# EAGLE schematic RBCX (EAGLE 9.6.0)

## Sheet 1 of 8: Power
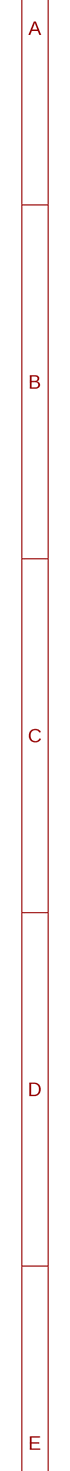
[diagram p0: schematic, sheet 1, part 1 of 2]
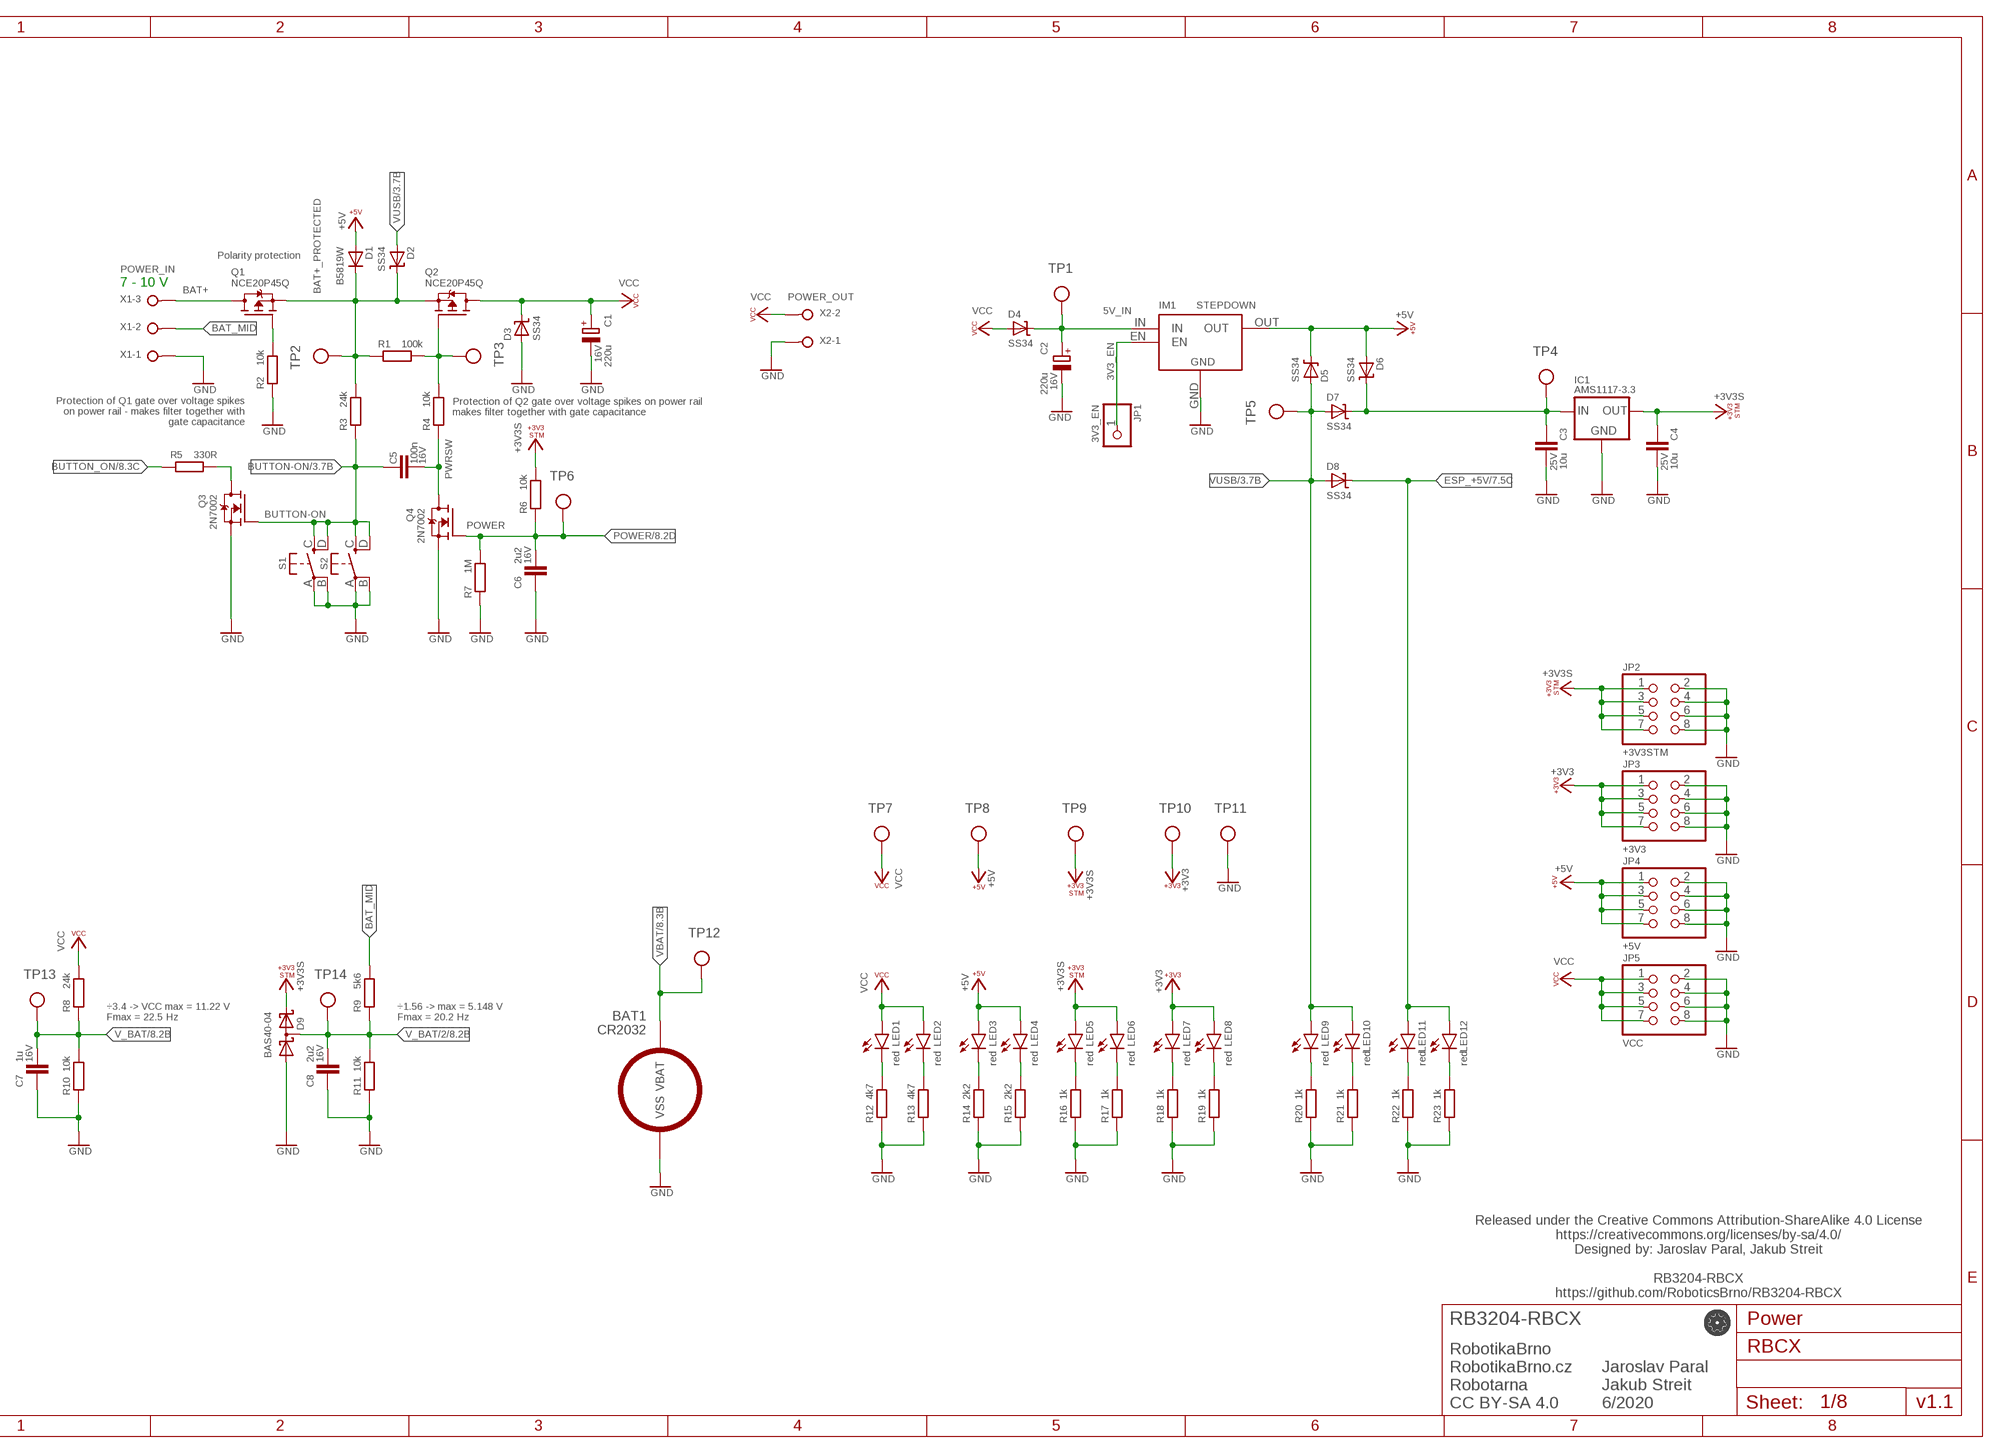
[diagram p1: schematic, sheet 1, part 2 of 2]

### Parts
BAT1  CR2032  CR2032CR2032-BS-6-1  [SMD-BAT-CR2032-BS-6-1]
C1  220u  CPOL-EUE5-10.5  [E5-10,5]
C2  220u  CPOL-EUE5-10.5  [E5-10,5]
C3  10u  C-EUC0805  [C0805]
C4  10u  C-EUC0805  [C0805]
C5  100n  C-EUC0402  [C0402]
C6  2u2  C-EUC0603  [C0603]
C7  1u  C-EUC0402  [C0402]
C8  2u2  C-EUC0603  [C0603]
D1  B5819W  DIODE-SOD123  [SOD123]
D2  SS34  SHOTTKY-SMA  [SMA]
D3  SS34  SHOTTKY-SMA  [SMA]
D4  SS34  SHOTTKY-SMA  [SMA]
D5  SS34  SHOTTKY-SMA  [SMA]
D6  SS34  SHOTTKY-SMA  [SMA]
D7  SS34  SHOTTKY-SMA  [SMA]
D8  SS34  SHOTTKY-SMA  [SMA]
D9  BAS40-04  [SOT23]
IC1  AMS1117-3.3  AMS1117  [SOT223]
IM1  STEPDOWN  [STEPDOWN]
JP1  3V3_EN  PINHD-1X1  [1X01]
JP2  +3V3STM  PINHD-2X4  [2X04]
JP3  +3V3  PINHD-2X4  [2X04]
JP4  +5V  PINHD-2X4  [2X04]
JP5  VCC  PINHD-2X4  [2X04]
LED1  red  LEDCHIPLED_0603  [CHIPLED_0603]
LED2  red  LEDCHIPLED_0603  [CHIPLED_0603]
LED3  red  LEDCHIPLED_0603  [CHIPLED_0603]
LED4  red  LEDCHIPLED_0603  [CHIPLED_0603]
LED5  red  LEDCHIPLED_0603  [CHIPLED_0603]
LED6  red  LEDCHIPLED_0603  [CHIPLED_0603]
LED7  red  LEDCHIPLED_0603  [CHIPLED_0603]
LED8  red  LEDCHIPLED_0603  [CHIPLED_0603]
LED9  red  LEDCHIPLED_0603  [CHIPLED_0603]
LED10  red  LEDCHIPLED_0603  [CHIPLED_0603]
LED11  red  LEDCHIPLED_0603  [CHIPLED_0603]
LED12  red  LEDCHIPLED_0603  [CHIPLED_0603]
Q1  NCE20P45Q  P-MOSFET-MLP_HS  [MLP3.3X3.3_HS]
Q2  NCE20P45Q  P-MOSFET-MLP_HS  [MLP3.3X3.3_HS]
Q3  2N7002  N-MOSFET-SOT23-GSD  [SOT23]
Q4  2N7002  N-MOSFET-SOT23-GSD  [SOT23]
R1  100k  R-EU_R0402  [R0402]
R2  10k  R-EU_R0402  [R0402]
R3  24k  R-EU_R0402  [R0402]
R4  10k  R-EU_R0402  [R0402]
R5  330R  R-EU_R0402  [R0402]
R6  10k  R-EU_R0402  [R0402]
R7  1M  R-EU_R0402  [R0402]
R8  24k  R-EU_R0402  [R0402]
R9  5k6  R-EU_R0402  [R0402]
R10  10k  R-EU_R0402  [R0402]
R11  10k  R-EU_R0402  [R0402]
R12  4k7  R-EU_R0402  [R0402]
R13  4k7  R-EU_R0402  [R0402]
R14  2k2  R-EU_R0402  [R0402]
R15  2k2  R-EU_R0402  [R0402]
R16  1k  R-EU_R0402  [R0402]
R17  1k  R-EU_R0402  [R0402]
R18  1k  R-EU_R0402  [R0402]
R19  1k  R-EU_R0402  [R0402]
R20  1k  R-EU_R0402  [R0402]
R21  1k  R-EU_R0402  [R0402]
R22  1k  R-EU_R0402  [R0402]
R23  1k  R-EU_R0402  [R0402]
S1  CHOOSE_ME  10-XX_SMD  [TS-1187A]
S2  CHOOSE_ME  10-XX_SMD  [TS-1187A]
TP1  TP_06MM  [TP_06]
TP2  TP_06MM  [TP_06]
TP3  TP_06MM  [TP_06]
TP4  TP_06MM  [TP_06]
TP5  TP_06MM  [TP_06]
TP6  TP_06MM  [TP_06]
TP7  TP_06MM  [TP_06]
TP8  TP_06MM  [TP_06]
TP9  TP_06MM  [TP_06]
TP10  TP_06MM  [TP_06]
TP11  TP_08MM  [TP_08]
TP12  TP_06MM  [TP_06]
TP13  TP_06MM  [TP_06]
TP14  TP_06MM  [TP_06]
X1  POWER_IN  W237-03P  [W237-133]
X2  POWER_OUT  W237-02P  [W237-132]

### Nets
3V3_EN: IM1.EN JP1.1 ; also sheet 2
3V3_IN: C3.2 D6.C D7.C IC1.3(IN) TP4.P$1(TP)
5V_IN: C2.+ D4.C IM1.IN TP1.P$1(TP)
+3V3: JP3.1 JP3.3 JP3.5 JP3.7 LED7.A LED8.A TP10.P$1(TP) ; also sheet 2,3,7
+3V3S: C4.2 D9.2(C2) IC1.2(OUT) IC1.4(OUT) JP2.1 JP2.3 JP2.5 JP2.7 LED5.A LED6.A R6.2 TP9.P$1(TP) ; also sheet 2,3,4,5,6,8
+5V: D1.A D5.C D6.A IM1.OUT JP4.1 JP4.3 JP4.5 JP4.7 LED3.A LED4.A TP8.P$1(TP) ; also sheet 2,3,4,5,6,7
BAT+: Q1.5(D) Q1.6(D) Q1.7(D) Q1.8(D) Q1.9(D) X1.3
BAT+_PROTECTED: D1.C D2.C Q1.1(S) Q1.2(S) Q1.3(S) Q2.1(S) Q2.2(S) Q2.3(S) R1.1 R3.2 TP2.P$1(TP)
BAT_MID: R9.2 X1.2
BUTTON-ON: C5.2 Q3.1(G) R3.1 S1.C(S) S1.D(S1) S2.C(S) S2.D(S1) ; also sheet 3,4
BUTTON-ON-LV: Q3.3(D) R5.2
BUTTON_ON: R5.1 ; also sheet 8
ESP_+5V: D8.C LED11.A LED12.A ; also sheet 7
GND: BAT1.VSS C1.- C2.- C3.1 C4.1 C6.2 C7.2 C8.2 D3.A D9.1(A1) IC1.1(GND) IM1.GND JP2.2 JP2.4 JP2.6 JP2.8 JP3.2 JP3.4 JP3.6 JP3.8 JP4.2 JP4.4 JP4.6 JP4.8 JP5.2 JP5.4 JP5.6 JP5.8 Q3.2(S) Q4.2(S) R2.1 R7.1 R10.1 R11.1 R12.1 R13.1 R14.1 R15.1 R16.1 R17.1 R18.1 R19.1 R20.1 R21.1 R22.1 R23.1 S1.A(P) S1.B(P1) S2.A(P) S2.B(P1) TP11.P$1(TP) X1.1 X2.1 ; also sheet 2,3,4,5,6,7,8
POWER: C6.1 Q4.1(G) R6.1 R7.2 TP6.P$1(TP) ; also sheet 8
PROT_GATE: Q1.4(G) R2.2
PWRLED_+3V3: LED7.C R18.2
PWRLED_+3V3B: LED8.C R19.2
PWRLED_+3V3S: LED5.C R16.2
PWRLED_+3V3S_B: LED6.C R17.2
PWRLED_+5V: LED3.C R14.2
PWRLED_+5V_B: LED4.C R15.2
PWRLED_+5VESP: LED11.C R22.2
PWRLED_+5VESP_B: LED12.C R23.2
PWRLED_VCC: LED1.C R12.2
PWRLED_VCC_B: LED2.C R13.2
PWRLED_VUSB: LED9.C R20.2
PWRLED_VUSB_B: LED10.C R21.2
PWRSW: C5.1 Q4.3(D) R4.1
PWRSW_GATE: Q2.4(G) R1.2 R4.2 TP3.P$1(TP)
V_BAT: C7.1 R8.1 R10.2 TP13.P$1(TP) ; also sheet 8
V_BAT/2: C8.1 D9.3(C1A2) R9.1 R11.2 TP14.P$1(TP) ; also sheet 8
VBAT: BAT1.VBAT TP12.P$1(TP) ; also sheet 8
VCC: C1.+ D3.C D4.A JP5.1 JP5.3 JP5.5 JP5.7 LED1.A LED2.A Q2.5(D) Q2.6(D) Q2.7(D) Q2.8(D) Q2.9(D) R8.2 TP7.P$1(TP) X2.2 ; also sheet 2,3,4,5,6
VUSB: D2.A D5.A D7.A D8.A LED9.A LED10.A TP5.P$1(TP) ; also sheet 3

### Notes on the sheet
- Polarity protection
- 7 - 10 V
- Protection of Q2 gate over voltage spikes on power rail
  makes filter together with gate capacitance
- Protection of Q1 gate over voltage spikes
  on power rail - makes filter together with
  gate capacitance
- ÷3.4 -> VCC max = 11.22 V
  Fmax = 22.5 Hz
- ÷1.56 -> max = 5.148 V
  Fmax = 20.2 Hz
- Released under the Creative Commons Attribution-ShareAlike 4.0 License
  https://creativecommons.org/licenses/by-sa/4.0/
  Designed by: Jaroslav Paral, Jakub Streit
  
  RB3204-RBCX
  https://github.com/RoboticsBrno/RB3204-RBCX
- RB3204-RBCX
- RobotikaBrno
  RobotikaBrno.cz
  Robotarna
  CC BY-SA 4.0
- Jaroslav Paral
  Jakub Streit
  6/2020
- v1.1

## Sheet 2 of 8: Connectors
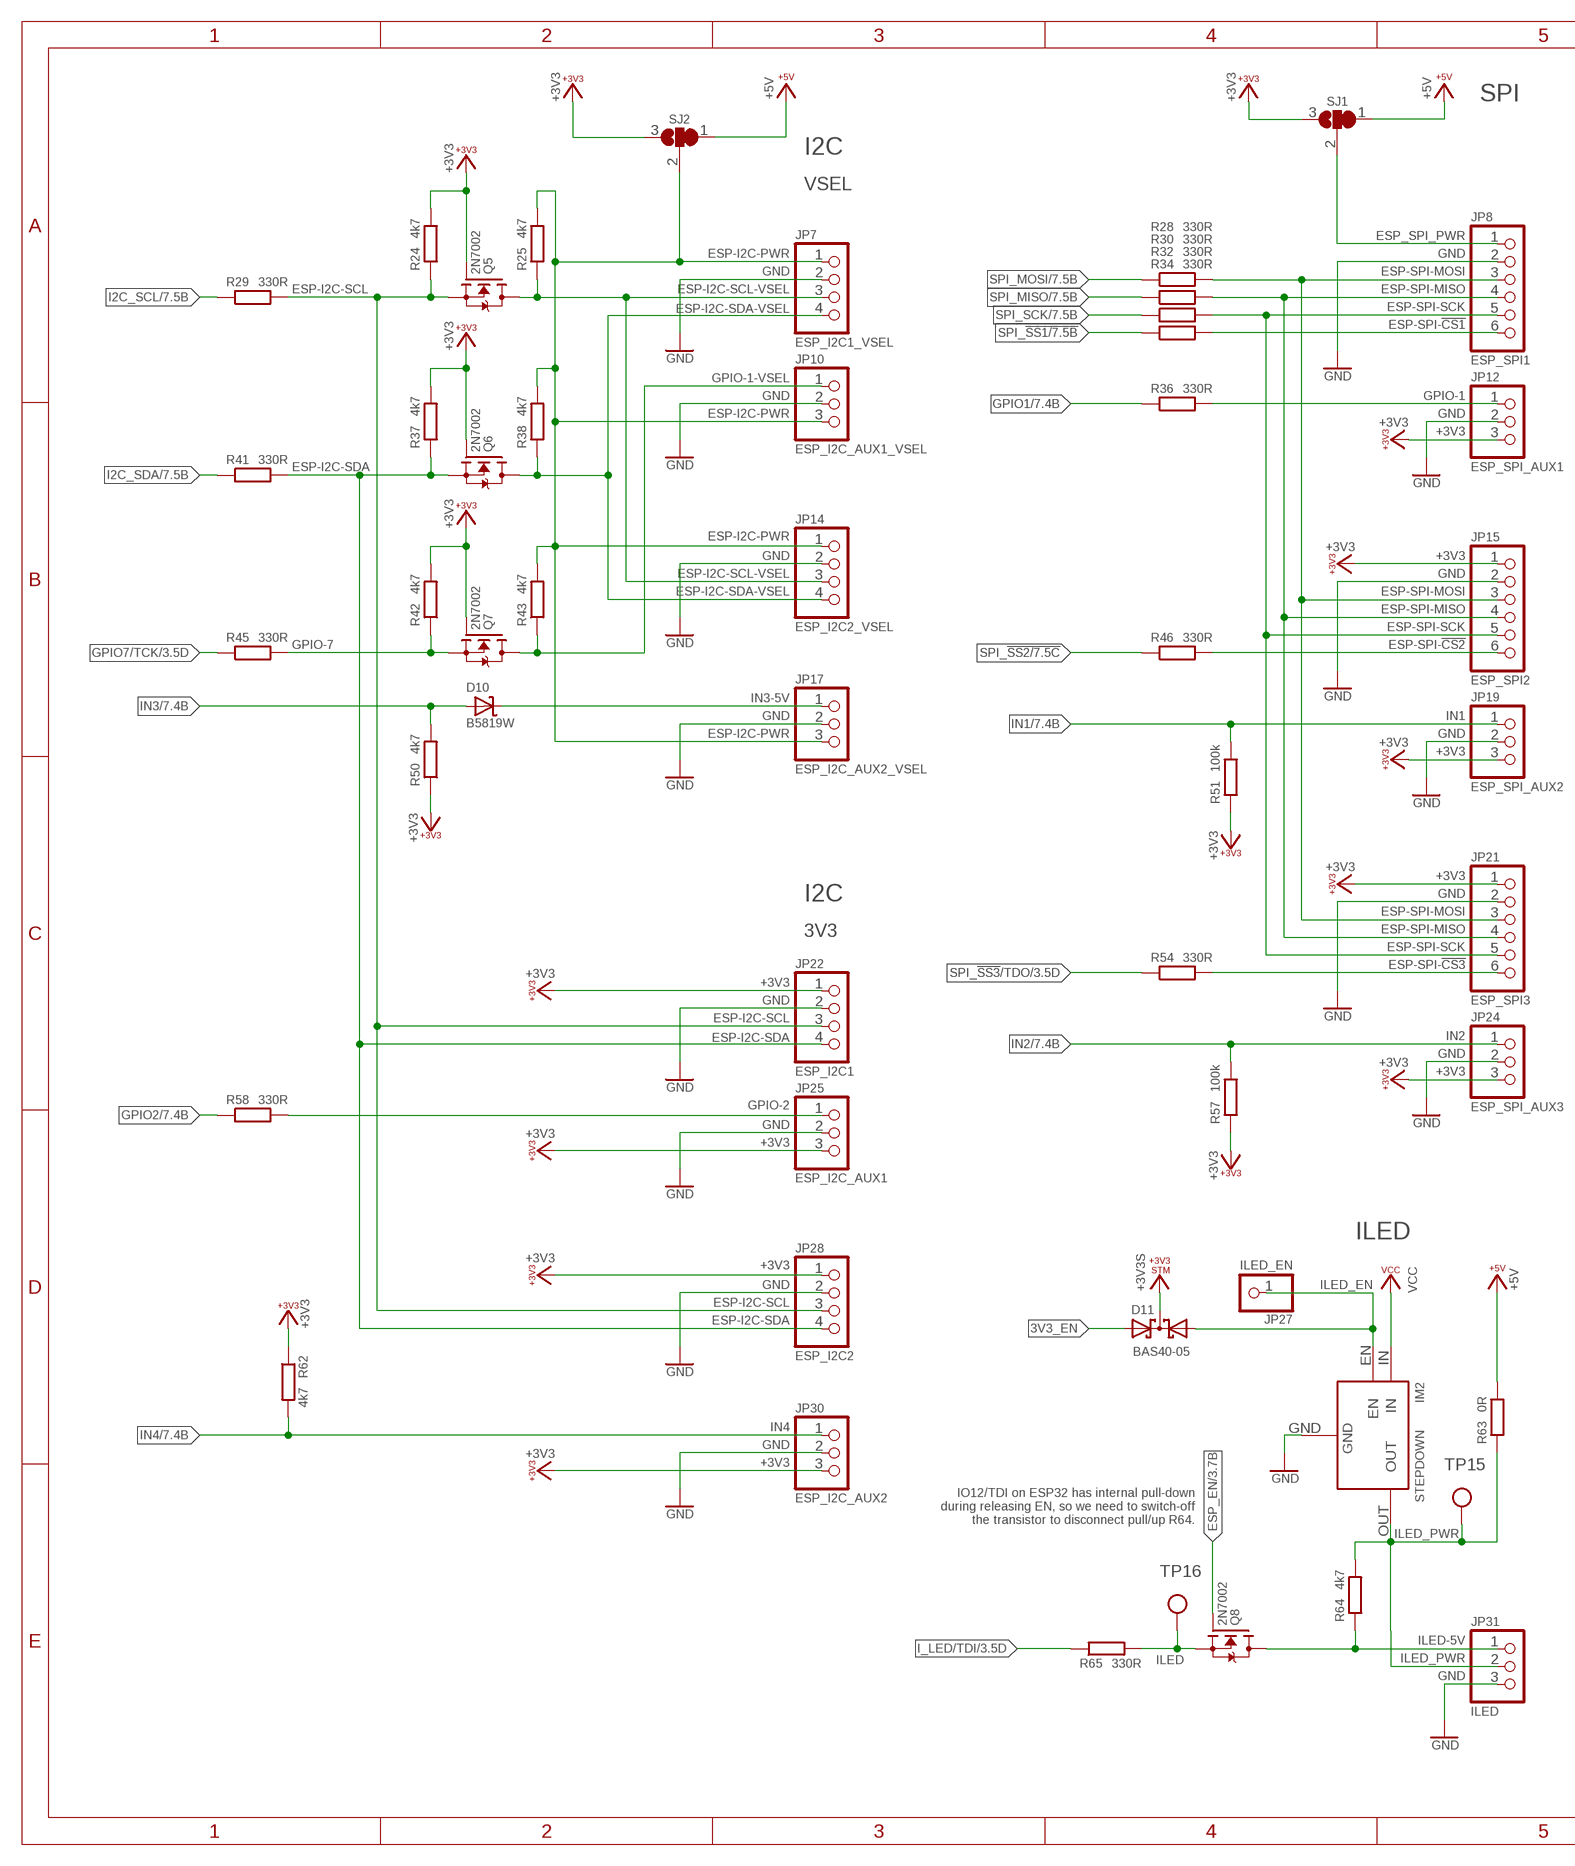
[diagram p2: schematic, sheet 2, part 1 of 2]
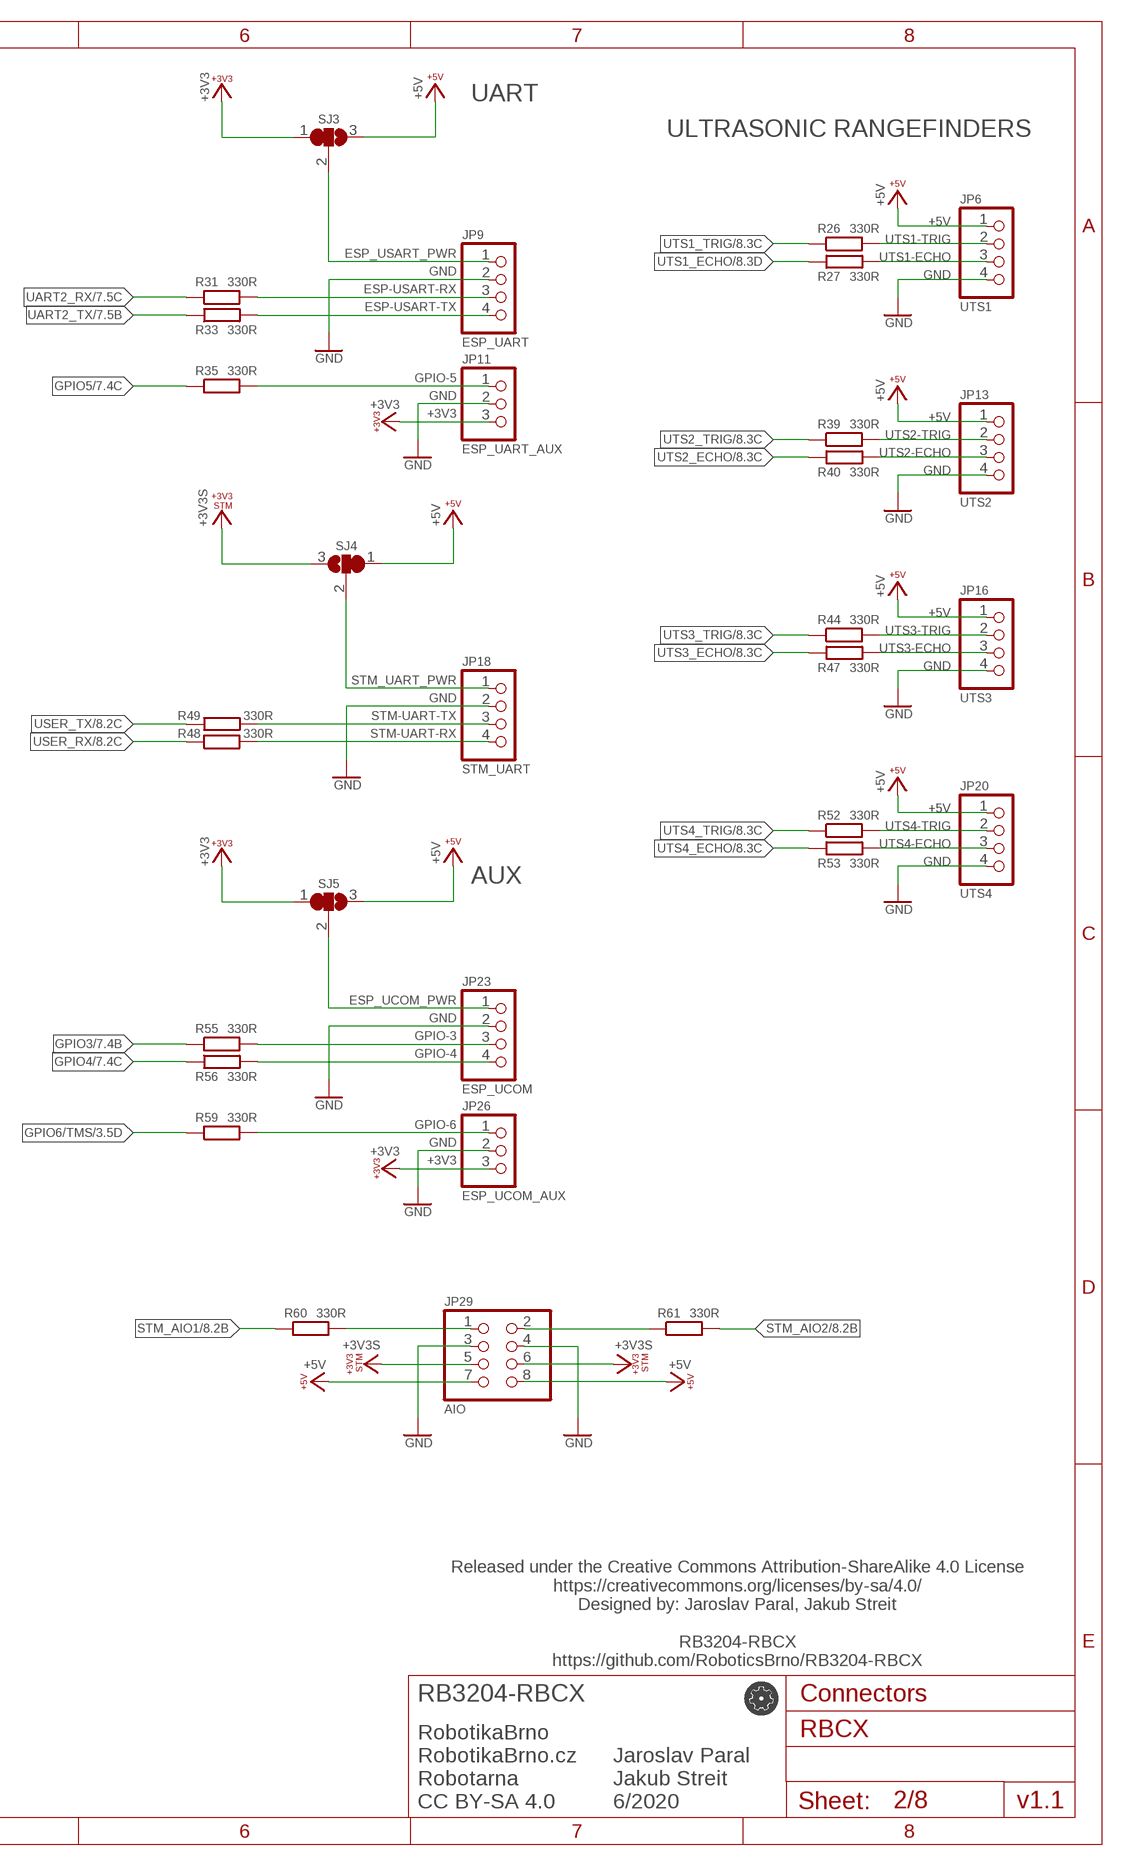
[diagram p3: schematic, sheet 2, part 2 of 2]

### Parts
D10  B5819W  SHOTTKY-SOD123  [SOD123]
D11  BAS40-05  [SOT23]
IM2  STEPDOWN  [STEPDOWN]
JP6  UTS1  PINHD-1X4  [1X04]
JP7  ESP_I2C1_VSEL  PINHD-1X4  [1X04]
JP8  ESP_SPI1  PINHD-1X6  [1X06]
JP9  ESP_UART  PINHD-1X4  [1X04]
JP10  ESP_I2C_AUX1_VSEL  PINHD-1X3  [1X03]
JP11  ESP_UART_AUX  PINHD-1X3  [1X03]
JP12  ESP_SPI_AUX1  PINHD-1X3  [1X03]
JP13  UTS2  PINHD-1X4  [1X04]
JP14  ESP_I2C2_VSEL  PINHD-1X4  [1X04]
JP15  ESP_SPI2  PINHD-1X6  [1X06]
JP16  UTS3  PINHD-1X4  [1X04]
JP17  ESP_I2C_AUX2_VSEL  PINHD-1X3  [1X03]
JP18  STM_UART  PINHD-1X4  [1X04]
JP19  ESP_SPI_AUX2  PINHD-1X3  [1X03]
JP20  UTS4  PINHD-1X4  [1X04]
JP21  ESP_SPI3  PINHD-1X6  [1X06]
JP22  ESP_I2C1  PINHD-1X4  [1X04]
JP23  ESP_UCOM  PINHD-1X4  [1X04]
JP24  ESP_SPI_AUX3  PINHD-1X3  [1X03]
JP25  ESP_I2C_AUX1  PINHD-1X3  [1X03]
JP26  ESP_UCOM_AUX  PINHD-1X3  [1X03]
JP27  ILED_EN  PINHD-1X1  [1X01]
JP28  ESP_I2C2  PINHD-1X4  [1X04]
JP29  AIO  PINHD-2X4  [2X04]
JP30  ESP_I2C_AUX2  PINHD-1X3  [1X03]
JP31  ILED  PINHD-1X3  [1X03]
Q5  2N7002  N-MOSFET-SOT23-GSD  [SOT23]
Q6  2N7002  N-MOSFET-SOT23-GSD  [SOT23]
Q7  2N7002  N-MOSFET-SOT23-GSD  [SOT23]
Q8  2N7002  N-MOSFET-SOT23-GSD  [SOT23]
R24  4k7  R-EU_R0402  [R0402]
R25  4k7  R-EU_R0402  [R0402]
R26  330R  R-EU_R0402  [R0402]
R27  330R  R-EU_R0402  [R0402]
R28  330R  R-EU_R0402  [R0402]
R29  330R  R-EU_R0402  [R0402]
R30  330R  R-EU_R0402  [R0402]
R31  330R  R-EU_R0402  [R0402]
R32  330R  R-EU_R0402  [R0402]
R33  330R  R-EU_R0402  [R0402]
R34  330R  R-EU_R0402  [R0402]
R35  330R  R-EU_R0402  [R0402]
R36  330R  R-EU_R0402  [R0402]
R37  4k7  R-EU_R0402  [R0402]
R38  4k7  R-EU_R0402  [R0402]
R39  330R  R-EU_R0402  [R0402]
R40  330R  R-EU_R0402  [R0402]
R41  330R  R-EU_R0402  [R0402]
R42  4k7  R-EU_R0402  [R0402]
R43  4k7  R-EU_R0402  [R0402]
R44  330R  R-EU_R0402  [R0402]
R45  330R  R-EU_R0402  [R0402]
R46  330R  R-EU_R0402  [R0402]
R47  330R  R-EU_R0402  [R0402]
R48  330R  R-EU_R0402  [R0402]
R49  330R  R-EU_R0402  [R0402]
R50  4k7  R-EU_R0402  [R0402]
R51  100k  R-EU_R0402  [R0402]
R52  330R  R-EU_R0402  [R0402]
R53  330R  R-EU_R0402  [R0402]
R54  330R  R-EU_R0402  [R0402]
R55  330R  R-EU_R0402  [R0402]
R56  330R  R-EU_R0402  [R0402]
R57  100k  R-EU_R0402  [R0402]
R58  330R  R-EU_R0402  [R0402]
R59  330R  R-EU_R0402  [R0402]
R60  330R  R-EU_R0402  [R0402]
R61  330R  R-EU_R0402  [R0402]
R62  4k7  R-EU_R0402  [R0402]
R63  0R  R-EU_R1206  [R1206]
R64  4k7  R-EU_R0402  [R0402]
R65  330R  R-EU_R0402  [R0402]
SJ1  SJ2W_DEFAULT  [SJ_2_DEFAULT]
SJ2  SJ2W_DEFAULT  [SJ_2_DEFAULT]
SJ3  SJ2W_DEFAULT  [SJ_2_DEFAULT]
SJ4  SJ2W_DEFAULT  [SJ_2_DEFAULT]
SJ5  SJ2W_DEFAULT  [SJ_2_DEFAULT]
TP15  TP_06MM  [TP_06]
TP16  TP_06MM  [TP_06]

### Nets
3V3_EN: D11.2(A2) ; also sheet 1
+3V3: JP11.3 JP12.3 JP15.1 JP19.3 JP21.1 JP22.1 JP24.3 JP25.3 JP26.3 JP28.1 JP30.3 Q5.1(G) Q6.1(G) Q7.1(G) R24.2 R37.2 R42.2 R50.1 R51.1 R57.1 R62.1 SJ1.3 SJ2.3 SJ3.1 SJ5.1 ; also sheet 1,3,7
+3V3S: D11.3(C) JP29.5 JP29.6 SJ4.3 ; also sheet 1,3,4,5,6,8
+5V: JP6.1 JP13.1 JP16.1 JP20.1 JP29.7 JP29.8 R63.2 SJ1.1 SJ2.1 SJ3.3 SJ4.1 SJ5.3 ; also sheet 1,3,4,5,6,7
ESP-I2C-PWR: JP7.1 JP10.3 JP14.1 JP17.3 R25.2 R38.2 R43.2 SJ2.2
ESP-I2C-SCL: JP22.3 JP28.3 Q5.2(S) R24.1 R29.2 ; also sheet 8
ESP-I2C-SCL-VSEL: JP7.3 JP14.3 Q5.3(D) R25.1
ESP-I2C-SDA: JP22.4 JP28.4 Q6.2(S) R37.1 R41.2 ; also sheet 8
ESP-I2C-SDA-VSEL: JP7.4 JP14.4 Q6.3(D) R38.1
ESP-SPI-!CS1: JP8.6 R34.2
ESP-SPI-!CS2: JP15.6 R46.2
ESP-SPI-!CS3: JP21.6 R54.2
ESP-SPI-MISO: JP8.4 JP15.4 JP21.4 R30.2
ESP-SPI-MOSI: JP8.3 JP15.3 JP21.3 R28.2
ESP-SPI-SCK: JP8.5 JP15.5 JP21.5 R32.2
ESP-USART-RX: JP9.3 R31.2
ESP-USART-TX: JP9.4 R33.2
ESP_EN: Q8.1(G) ; also sheet 3,4,7,8
ESP_SPI_PWR: JP8.1 SJ1.2
ESP_UCOM_PWR: JP23.1 SJ5.2
ESP_USART_PWR: JP9.1 SJ3.2
GND: IM2.GND JP6.4 JP7.2 JP8.2 JP9.2 JP10.2 JP11.2 JP12.2 JP13.4 JP14.2 JP15.2 JP16.4 JP17.2 JP18.2 JP19.2 JP20.4 JP21.2 JP22.2 JP23.2 JP24.2 JP25.2 JP26.2 JP28.2 JP29.3 JP29.4 JP30.2 JP31.3 ; also sheet 1,3,4,5,6,7,8
GPIO1: R36.1 ; also sheet 7
GPIO2: R58.1 ; also sheet 7
GPIO3: R55.1 ; also sheet 7
GPIO4: R56.1 ; also sheet 7
GPIO5: R35.1 ; also sheet 7
GPIO6/TMS: R59.1 ; also sheet 3,7
GPIO7/TCK: R45.1 ; also sheet 3,7
GPIO-1: JP12.1 R36.2
GPIO-1-VSEL: JP10.1 Q7.3(D) R43.1
GPIO-2: JP25.1 R58.2 ; also sheet 3
GPIO-3: JP23.3 R55.2
GPIO-4: JP23.4 R56.2
GPIO-5: JP11.1 R35.2
GPIO-6: JP26.1 R59.2
GPIO-7: Q7.2(S) R42.1 R45.2
I2C_SCL: R29.1 ; also sheet 7
I2C_SDA: R41.1 ; also sheet 7
I_LED/TDI: R65.1 ; also sheet 3,7
ILED: Q8.2(S) R65.2 TP16.P$1(TP)
ILED-5V: JP31.1 Q8.3(D) R64.1 ; also sheet 3
ILED_EN: D11.1(A1) IM2.EN JP27.1
ILED_PWR: IM2.OUT JP31.2 R63.1 R64.2 TP15.P$1(TP)
IN1: JP19.1 R51.2 ; also sheet 7
IN2: JP24.1 R57.2 ; also sheet 7
IN3: D10.A R50.2 ; also sheet 7
IN3-5V: D10.C JP17.1
IN4: JP30.1 R62.2 ; also sheet 7
SPI_!SS1: R34.1 ; also sheet 7
SPI_!SS2: R46.1 ; also sheet 7
SPI_!SS3!/TDO: R54.1 ; also sheet 3,7
SPI_MISO: R30.1 ; also sheet 7
SPI_MOSI: R28.1 ; also sheet 7
SPI_SCK: R32.1 ; also sheet 7
STM-AIO1: JP29.1 R60.2
STM-AIO2: JP29.2 R61.1
STM-UART-RX: JP18.4 R49.2
STM-UART-TX: JP18.3 R48.2
STM_AIO1: R60.1 ; also sheet 8
STM_AIO2: R61.2 ; also sheet 8
STM_UART_PWR: JP18.1 SJ4.2
UART2_RX: R31.1 ; also sheet 7
UART2_TX: R33.1 ; also sheet 7
USER_RX: R49.1 ; also sheet 8
USER_TX: R48.1 ; also sheet 8
UTS1-ECHO: JP6.3 R27.2
UTS1-TRIG: JP6.2 R26.2
UTS1_ECHO: R27.1 ; also sheet 8
UTS1_TRIG: R26.1 ; also sheet 8
UTS2-ECHO: JP13.3 R40.2
UTS2-TRIG: JP13.2 R39.2
UTS2_ECHO: R40.1 ; also sheet 8
UTS2_TRIG: R39.1 ; also sheet 8
UTS3-ECHO: JP16.3 R47.2
UTS3-TRIG: JP16.2 R44.2
UTS3_ECHO: R47.1 ; also sheet 8
UTS3_TRIG: R44.1 ; also sheet 8
UTS4-ECHO: JP20.3 R53.2
UTS4-TRIG: JP20.2 R52.2
UTS4_ECHO: R53.1 ; also sheet 8
UTS4_TRIG: R52.1 ; also sheet 8
VCC: IM2.IN ; also sheet 1,3,4,5,6

### Notes on the sheet
- SPI | UART
- ULTRASONIC RANGEFINDERS
- I2C
- VSEL
- AUX
- I2C
- 3V3
- ILED
- IO12/TDI on ESP32 has internal pull-down
  during releasing EN, so we need to switch-off
  the transistor to disconnect pull/up R64.
- Released under the Creative Commons Attribution-ShareAlike 4.0 License
  https://creativecommons.org/licenses/by-sa/4.0/
  Designed by: Jaroslav Paral, Jakub Streit
  
  RB3204-RBCX
  https://github.com/RoboticsBrno/RB3204-RBCX
- RB3204-RBCX
- RobotikaBrno
  RobotikaBrno.cz
  Robotarna
  CC BY-SA 4.0
- Jaroslav Paral
  Jakub Streit
  6/2020
- v1.1

## Sheet 3 of 8: Auxiliary connectors
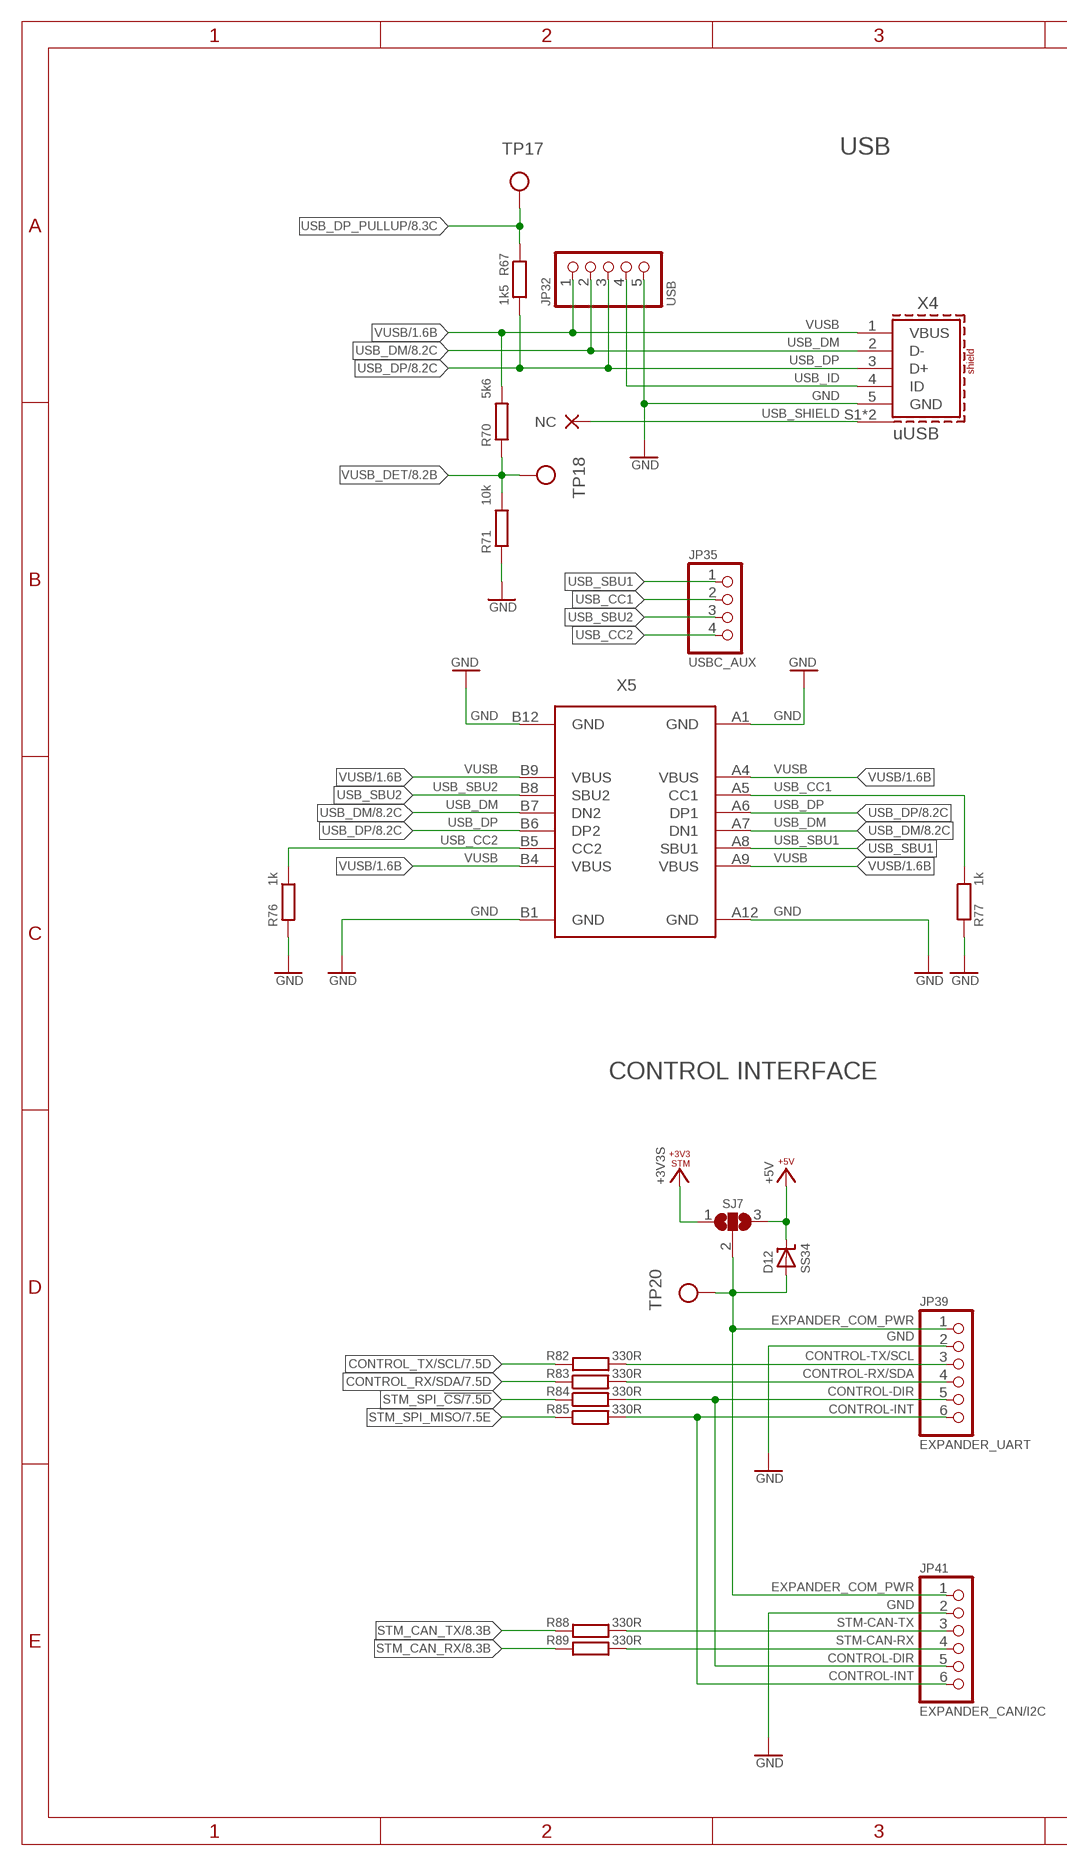
[diagram p4: schematic, sheet 3, part 1 of 2]
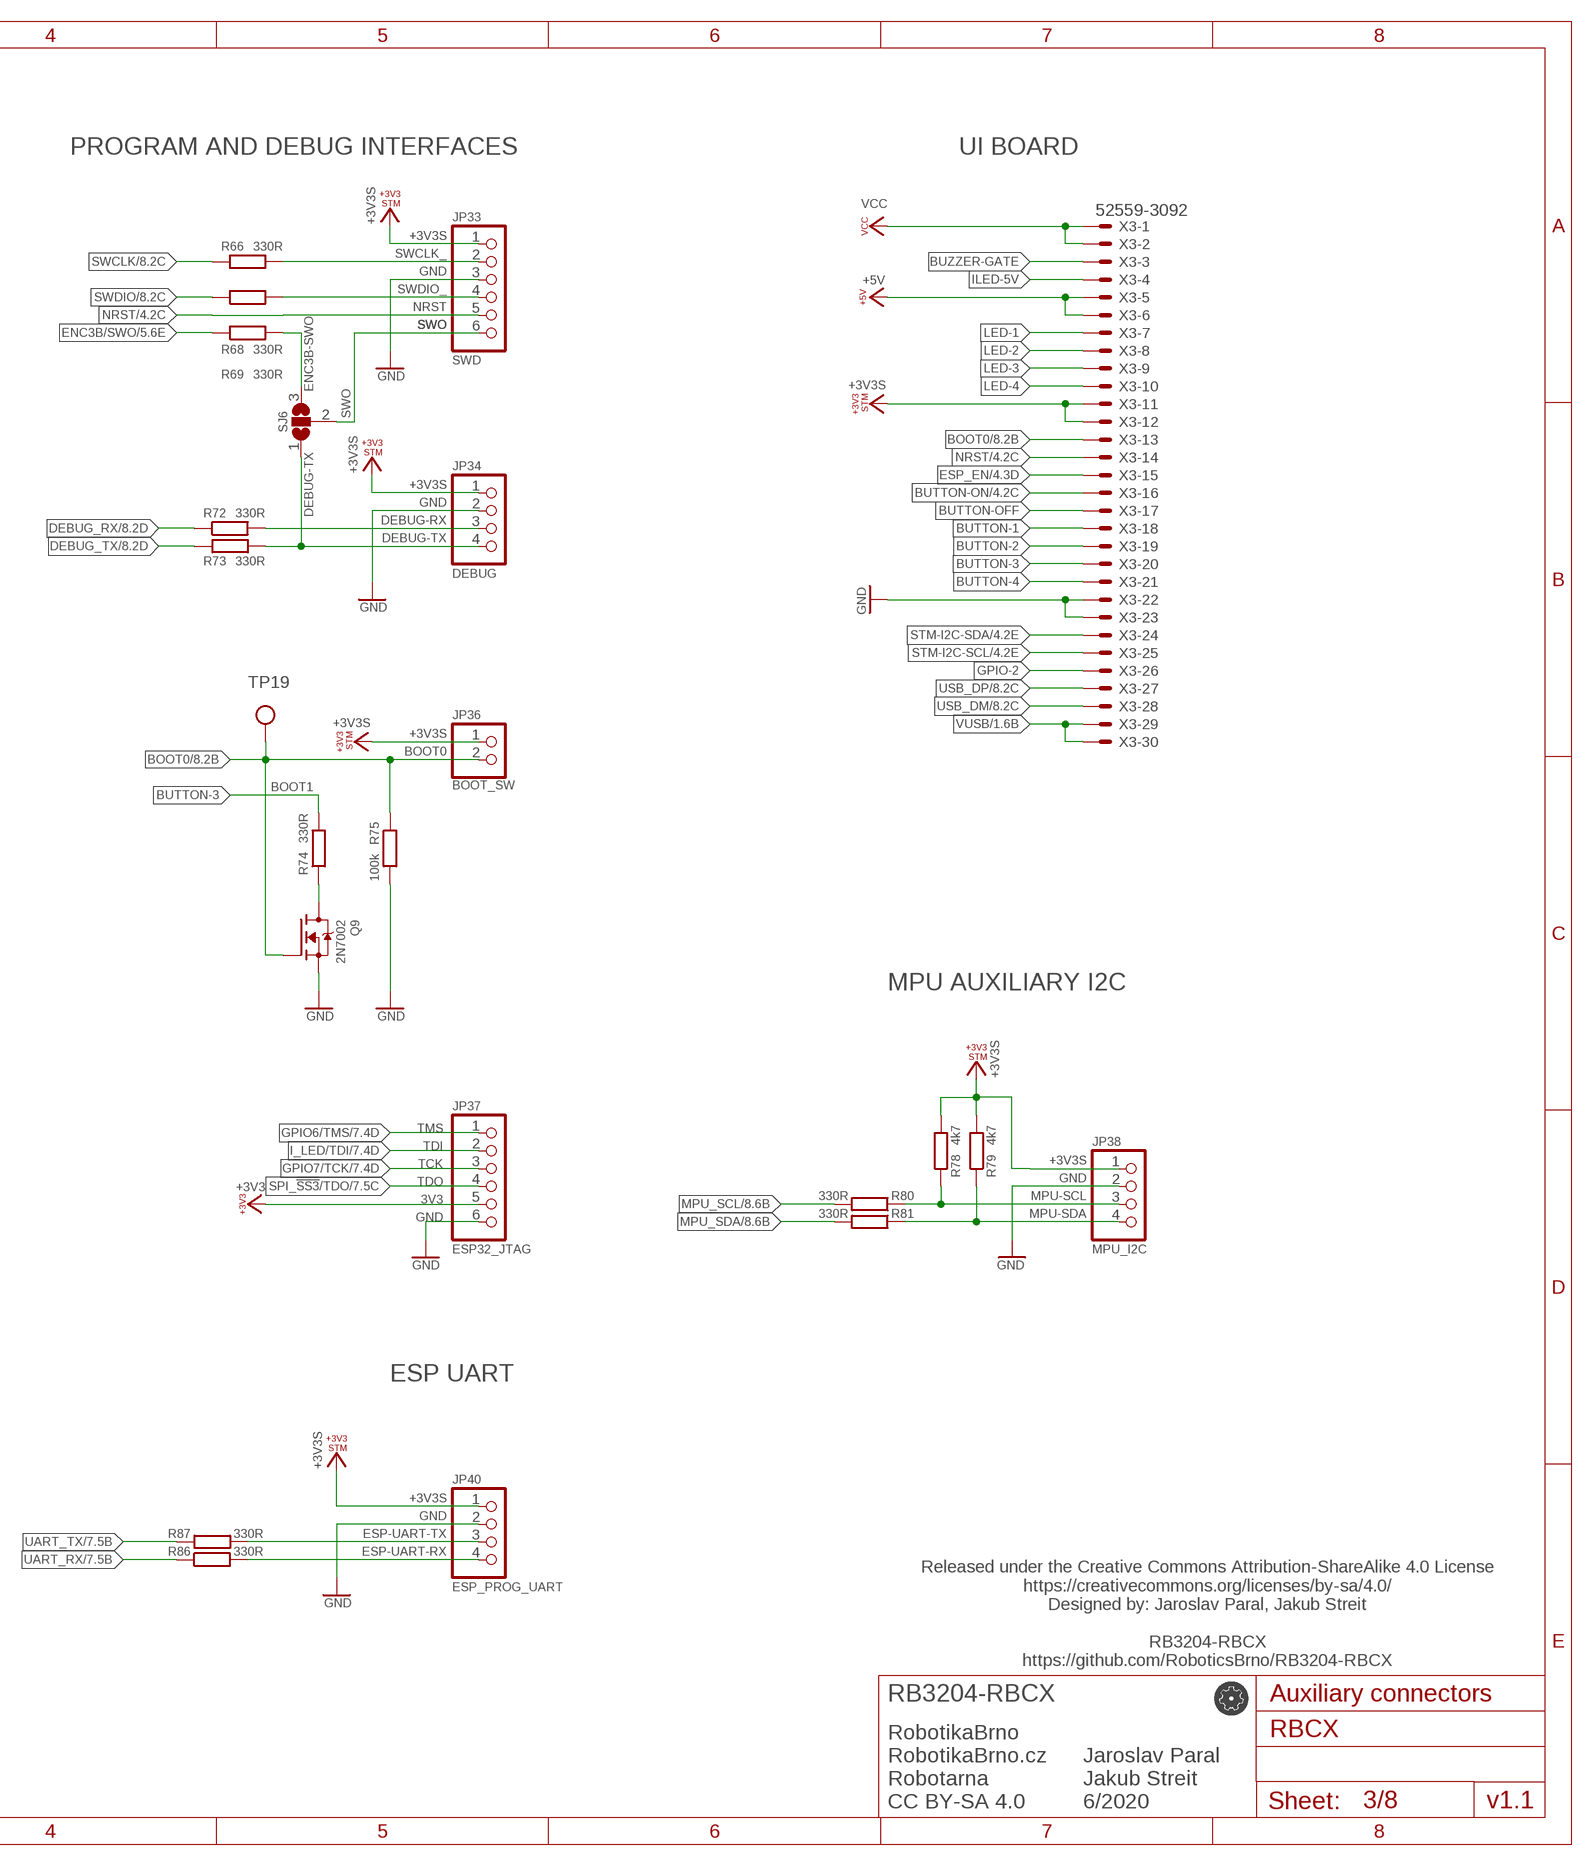
[diagram p5: schematic, sheet 3, part 2 of 2]

### Parts
D12  SS34  SHOTTKY-SMA  [SMA]
JP32  USB  PINHD-1X5  [1X05]
JP33  SWD  PINHD-1X6  [1X06]
JP34  DEBUG  PINHD-1X4  [1X04]
JP35  USBC_AUX  PINHD-1X4  [1X04]
JP36  BOOT_SW  PINHD-1X2  [1X02]
JP37  ESP32_JTAG  PINHD-1X6  [1X06]
JP38  MPU_I2C  PINHD-1X4  [1X04]
JP39  EXPANDER_UART  PINHD-1X6  [1X06]
JP40  ESP_PROG_UART  PINHD-1X4  [1X04]
JP41  EXPANDER_CAN/I2C  PINHD-1X6  [1X06]
NC8  NC  (no package)
Q9  2N7002  N-MOSFET-SOT23-GSD  [SOT23]
R66  330R  R-EU_R0402  [R0402]
R67  1k5  R-EU_R0402  [R0402]
R68  330R  R-EU_R0402  [R0402]
R69  330R  R-EU_R0402  [R0402]
R70  5k6  R-EU_R0402  [R0402]
R71  10k  R-EU_R0402  [R0402]
R72  330R  R-EU_R0402  [R0402]
R73  330R  R-EU_R0402  [R0402]
R74  330R  R-EU_R0402  [R0402]
R75  100k  R-EU_R0402  [R0402]
R76  1k  R-EU_R0402  [R0402]
R77  1k  R-EU_R0402  [R0402]
R78  4k7  R-EU_R0402  [R0402]
R79  4k7  R-EU_R0402  [R0402]
R80  330R  R-EU_R0402  [R0402]
R81  330R  R-EU_R0402  [R0402]
R82  330R  R-EU_R0402  [R0402]
R83  330R  R-EU_R0402  [R0402]
R84  330R  R-EU_R0402  [R0402]
R85  330R  R-EU_R0402  [R0402]
R86  330R  R-EU_R0402  [R0402]
R87  330R  R-EU_R0402  [R0402]
R88  330R  R-EU_R0402  [R0402]
R89  330R  R-EU_R0402  [R0402]
SJ6  SJ2W0603  [SJ_2_0603]
SJ7  SJ2W0603  [SJ_2_0603]
TP17  TP_06MM  [TP_06]
TP18  TP_06MM  [TP_06]
TP19  TP_06MM  [TP_06]
TP20  TP_06MM  [TP_06]
X3  52559-3092  [52559-3092]
X4  uUSB  614105150621  [614105150621]
X5  USB_C_8PIN  [USB_C_VERT_THT_8PIN]

### Nets
+3V3: JP37.5 ; also sheet 1,2,7
+3V3S: JP33.1 JP34.1 JP36.1 JP38.1 JP40.1 R78.2 R79.2 SJ7.1 X3.11 X3.12 ; also sheet 1,2,4,5,6,8
+5V: D12.C SJ7.3 X3.5 X3.6 ; also sheet 1,2,4,5,6,7
BOOT0: JP36.2 Q9.1(G) R75.1 TP19.P$1(TP) X3.13 ; also sheet 8
BOOT1_PULL-DOWN: Q9.3(D) R74.1
BUTTON-1: X3.18 ; also sheet 4
BUTTON-2: X3.19 ; also sheet 4
BUTTON-3: R74.2 X3.20 ; also sheet 4
BUTTON-4: X3.21 ; also sheet 4
BUTTON-OFF: X3.17 ; also sheet 4
BUTTON-ON: X3.16 ; also sheet 1,4
BUZZER-GATE: X3.3 ; also sheet 4
CONTROL-DIR: JP39.5 JP41.5 R84.2
CONTROL-INT: JP39.6 JP41.6 R85.2
CONTROL-RX/SDA: JP39.4 R83.2
CONTROL-TX/SCL: JP39.3 R82.2
CONTROL_RX/SDA: R83.1 ; also sheet 7,8
CONTROL_TX/SCL: R82.1 ; also sheet 7,8
DEBUG-RX: JP34.3 R72.2
DEBUG-TX: JP34.4 R73.2 SJ6.1
DEBUG_RX: R72.1 ; also sheet 8
DEBUG_TX: R73.1 ; also sheet 8
ENC3B-SWO: R69.2 SJ6.3
ENC3B/SWO: R69.1 ; also sheet 5,8
ESP-UART-RX: JP40.4 R87.2
ESP-UART-TX: JP40.3 R86.2
ESP_EN: X3.15 ; also sheet 2,4,7,8
EXPANDER_COM_PWR: D12.A JP39.1 JP41.1 SJ7.2 TP20.P$1(TP)
GND: JP32.5 JP33.3 JP34.2 JP37.6 JP38.2 JP39.2 JP40.2 JP41.2 Q9.2(S) R71.1 R75.2 R76.2 R77.2 X3.22 X3.23 X4.5(GND) X5.A1(GND) X5.A12(GND) X5.B1(GND) X5.B12(GND) ; also sheet 1,2,4,5,6,7,8
GPIO6/TMS: JP37.1 ; also sheet 2,7
GPIO7/TCK: JP37.3 ; also sheet 2,7
GPIO-2: X3.26 ; also sheet 2
I_LED/TDI: JP37.2 ; also sheet 2,7
ILED-5V: X3.4 ; also sheet 2
LED-1: X3.7 ; also sheet 4
LED-2: X3.8 ; also sheet 4
LED-3: X3.9 ; also sheet 4
LED-4: X3.10 ; also sheet 4
MPU-SCL: JP38.3 R78.1 R80.1
MPU-SDA: JP38.4 R79.1 R81.1
MPU_SCL: R80.2 ; also sheet 8
MPU_SDA: R81.2 ; also sheet 8
NRST: JP33.5 X3.14 ; also sheet 4,8
SPI_!SS3!/TDO: JP37.4 ; also sheet 2,7
STM-CAN-RX: JP41.4 R89.2
STM-CAN-TX: JP41.3 R88.2
STM-I2C-SCL: X3.25 ; also sheet 4,8
STM-I2C-SDA: X3.24 ; also sheet 4,8
STM_CAN_RX: R89.1 ; also sheet 8
STM_CAN_TX: R88.1 ; also sheet 8
STM_SPI_!CS: R84.1 ; also sheet 7,8
STM_SPI_MISO: R85.1 ; also sheet 7,8
SWCLK: R66.1 ; also sheet 8
SWCLK_: JP33.2 R66.2
SWDIO: R68.1 ; also sheet 8
SWDIO_: JP33.4 R68.2
SWO: JP33.6 SJ6.2
UART_RX: R87.1 ; also sheet 7
UART_TX: R86.1 ; also sheet 7
USB_CC1: JP35.2 R77.1 X5.A5(CC1)
USB_CC2: JP35.4 R76.1 X5.B5(CC2)
USB_DM: JP32.2 X3.28 X4.2(D-) X5.A7(DN1) X5.B7(DN2) ; also sheet 8
USB_DP: JP32.3 R67.2 X3.27 X4.3(D+) X5.A6(DP1) X5.B6(DP2) ; also sheet 8
USB_DP_PULLUP: R67.1 TP17.P$1(TP) ; also sheet 8
USB_ID: JP32.4 X4.4(ID)
USB_SBU1: JP35.1 X5.A8(SBU1)
USB_SBU2: JP35.3 X5.B8(SBU2)
USB_SHIELD: NC8.NC X4.S1(SHIELD) X4.S2(SHIELD)
VCC: X3.1 X3.2 ; also sheet 1,2,4,5,6
VUSB: JP32.1 R70.2 X3.29 X3.30 X4.1(VBUS) X5.A4(VBUS) X5.A9(VBUS) X5.B4(VBUS) X5.B9(VBUS) ; also sheet 1
VUSB_DET: R70.1 R71.2 TP18.P$1(TP) ; also sheet 8

### Notes on the sheet
- USB | PROGRAM AND DEBUG INTERFACES | UI BOARD
- BOOT1
- MPU AUXILIARY I2C
- CONTROL INTERFACE
- TMS
- TDI
- TCK
- TDO
- 3V3
- GND
- ESP UART
- Released under the Creative Commons Attribution-ShareAlike 4.0 License
  https://creativecommons.org/licenses/by-sa/4.0/
  Designed by: Jaroslav Paral, Jakub Streit
  
  RB3204-RBCX
  https://github.com/RoboticsBrno/RB3204-RBCX
- RB3204-RBCX
- RobotikaBrno
  RobotikaBrno.cz
  Robotarna
  CC BY-SA 4.0
- Jaroslav Paral
  Jakub Streit
  6/2020
- v1.1

## Sheet 4 of 8: User interface
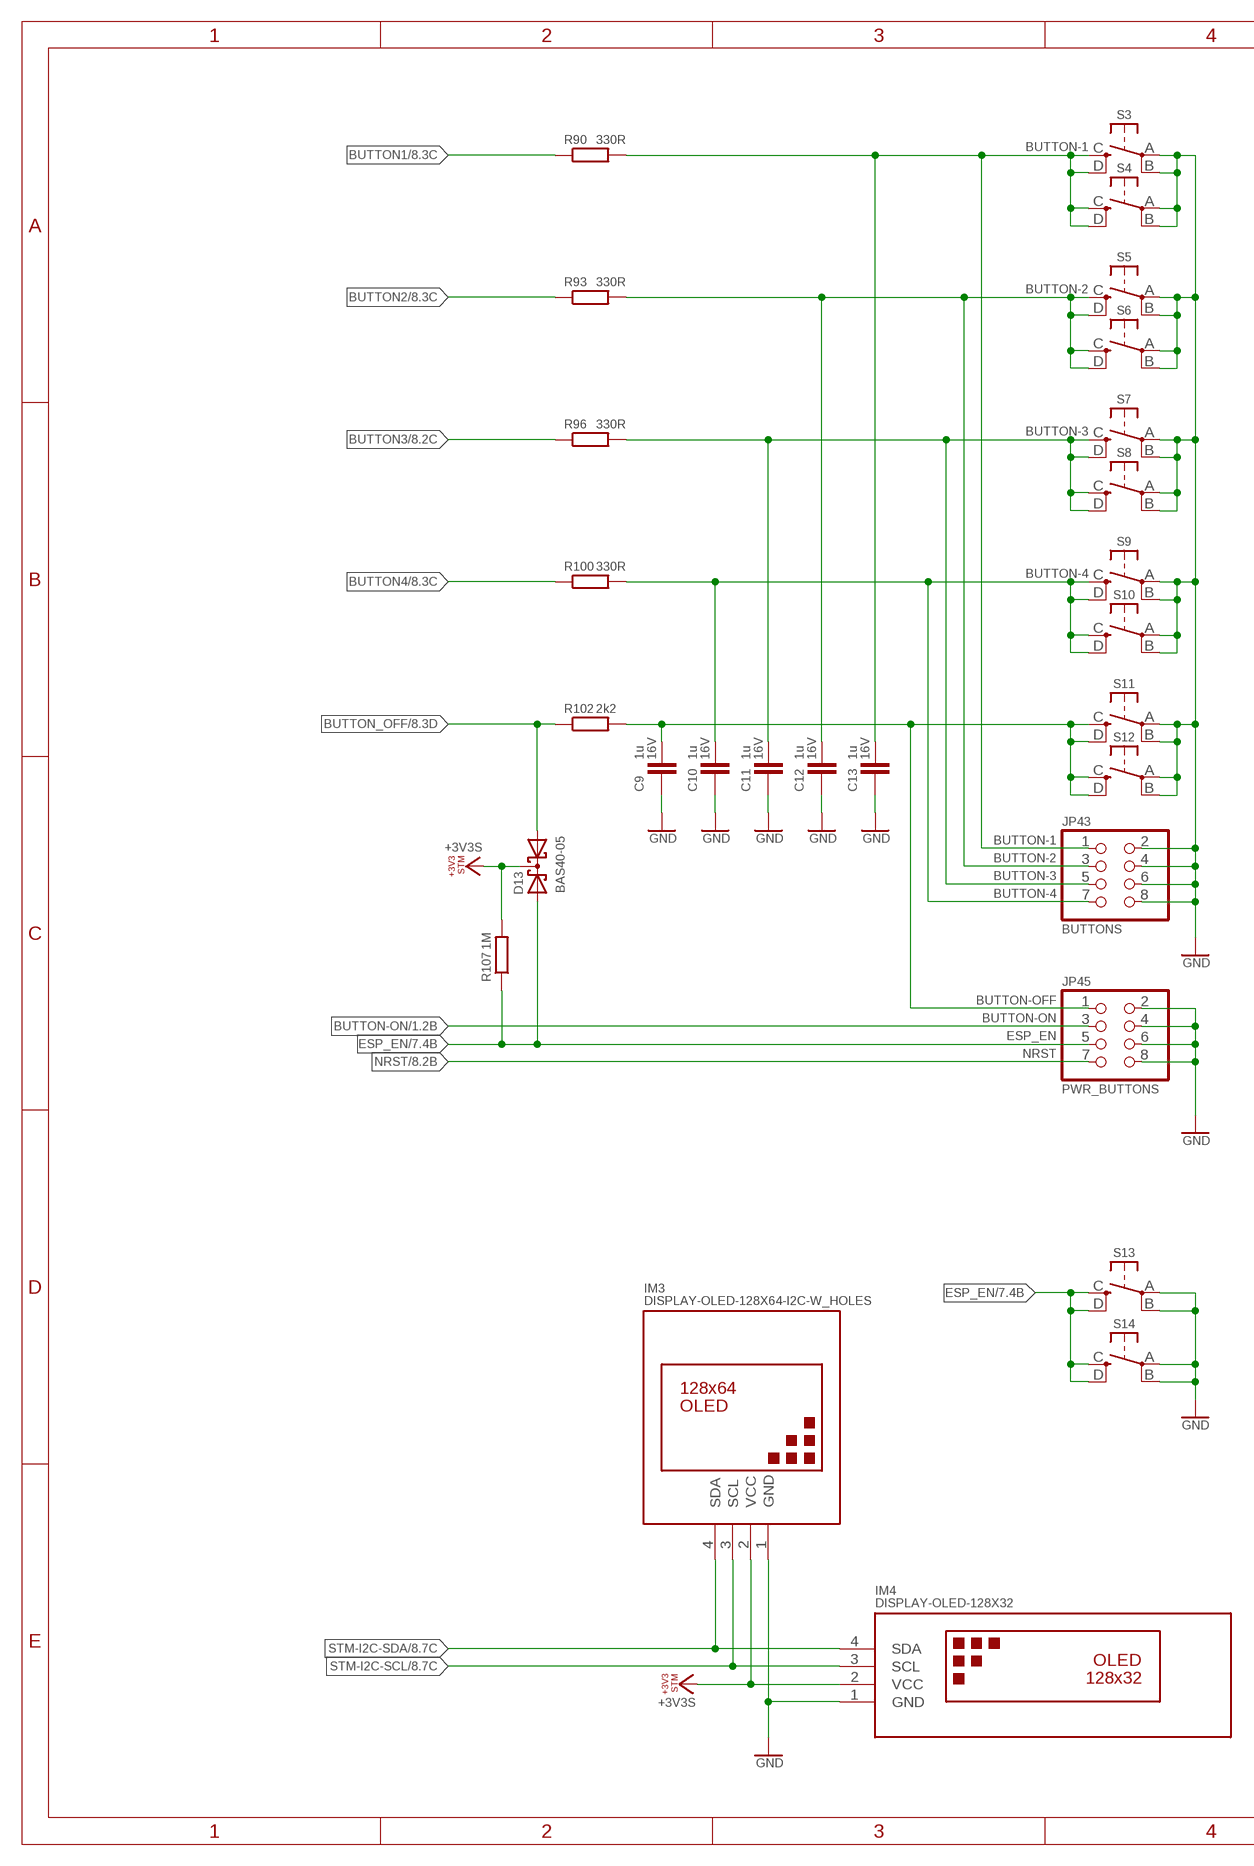
[diagram p6: schematic, sheet 4, part 1 of 2]
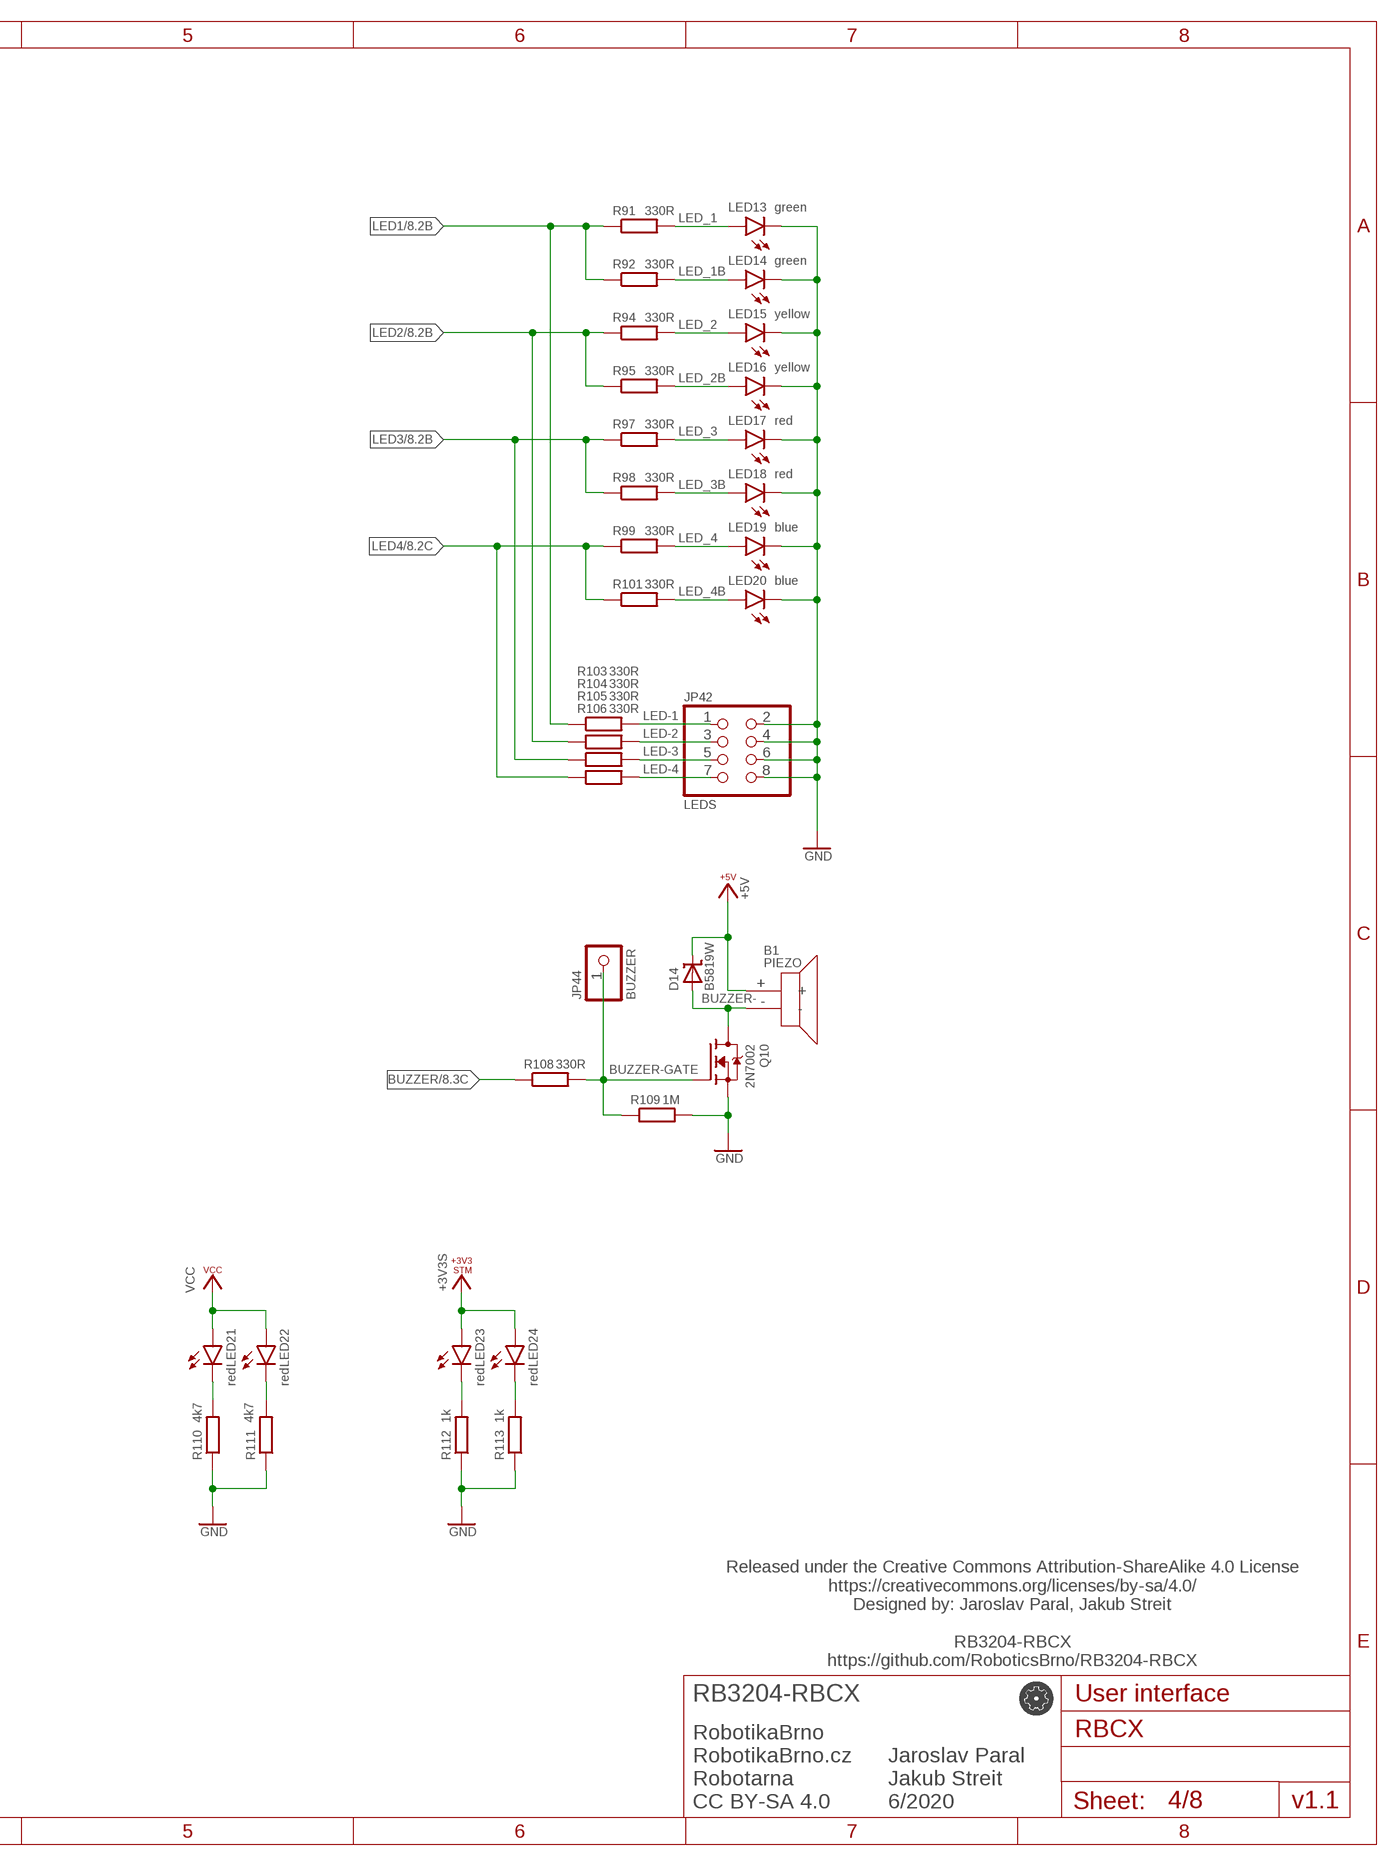
[diagram p7: schematic, sheet 4, part 2 of 2]

### Parts
B1  PIEZO  [PIEZO]
C9  1u  C-EUC0402  [C0402]
C10  1u  C-EUC0402  [C0402]
C11  1u  C-EUC0402  [C0402]
C12  1u  C-EUC0402  [C0402]
C13  1u  C-EUC0402  [C0402]
D13  BAS40-05  [SOT23]
D14  B5819W  SHOTTKY-SOD123  [SOD123]
IM3  DISPLAY-OLED-128X64-I2C-W_HOLES  [DISPLAY-OLED-128X64-I2C_W-HOLES]
IM4  DISPLAY-OLED-128X32  [DISPLAY-OLED-128X32]
JP42  LEDS  PINHD-2X4  [2X04]
JP43  BUTTONS  PINHD-2X4  [2X04]
JP44  BUZZER  PINHD-1X1  [1X01]
JP45  PWR_BUTTONS  PINHD-2X4  [2X04]
LED13  green  LEDCHIPLED_0603  [CHIPLED_0603]
LED14  green  LEDCHIPLED_0603  [CHIPLED_0603]
LED15  yellow  LEDCHIPLED_0603  [CHIPLED_0603]
LED16  yellow  LEDCHIPLED_0603  [CHIPLED_0603]
LED17  red  LEDCHIPLED_0603  [CHIPLED_0603]
LED18  red  LEDCHIPLED_0603  [CHIPLED_0603]
LED19  blue  LEDCHIPLED_0603  [CHIPLED_0603]
LED20  blue  LEDCHIPLED_0603  [CHIPLED_0603]
LED21  red  LEDCHIPLED_0603  [CHIPLED_0603]
LED22  red  LEDCHIPLED_0603  [CHIPLED_0603]
LED23  red  LEDCHIPLED_0603  [CHIPLED_0603]
LED24  red  LEDCHIPLED_0603  [CHIPLED_0603]
Q10  2N7002  N-MOSFET-SOT23-GSD  [SOT23]
R90  330R  R-EU_R0402  [R0402]
R91  330R  R-EU_R0402  [R0402]
R92  330R  R-EU_R0402  [R0402]
R93  330R  R-EU_R0402  [R0402]
R94  330R  R-EU_R0402  [R0402]
R95  330R  R-EU_R0402  [R0402]
R96  330R  R-EU_R0402  [R0402]
R97  330R  R-EU_R0402  [R0402]
R98  330R  R-EU_R0402  [R0402]
R99  330R  R-EU_R0402  [R0402]
R100  330R  R-EU_R0402  [R0402]
R101  330R  R-EU_R0402  [R0402]
R102  2k2  R-EU_R0402  [R0402]
R103  330R  R-EU_R0402  [R0402]
R104  330R  R-EU_R0402  [R0402]
R105  330R  R-EU_R0402  [R0402]
R106  330R  R-EU_R0402  [R0402]
R107  1M  R-EU_R0402  [R0402]
R108  330R  R-EU_R0402  [R0402]
R109  1M  R-EU_R0402  [R0402]
R110  4k7  R-EU_R0402  [R0402]
R111  4k7  R-EU_R0402  [R0402]
R112  1k  R-EU_R0402  [R0402]
R113  1k  R-EU_R0402  [R0402]
S3  CHOOSE_ME  10-XX_SMD  [TS-1187A]
S4  CHOOSE_ME  10-XX_SMD  [TS-1187A]
S5  CHOOSE_ME  10-XX_SMD  [TS-1187A]
S6  CHOOSE_ME  10-XX_SMD  [TS-1187A]
S7  CHOOSE_ME  10-XX_SMD  [TS-1187A]
S8  CHOOSE_ME  10-XX_SMD  [TS-1187A]
S9  CHOOSE_ME  10-XX_SMD  [TS-1187A]
S10  CHOOSE_ME  10-XX_SMD  [TS-1187A]
S11  CHOOSE_ME  10-XX_SMD  [TS-1187A]
S12  CHOOSE_ME  10-XX_SMD  [TS-1187A]
S13  CHOOSE_ME  10-XX_SMD  [TS-1187A]
S14  CHOOSE_ME  10-XX_SMD  [TS-1187A]

### Nets
+3V3S: D13.3(C) IM3.2(VCC) IM4.2(VCC) LED23.A LED24.A R107.2 ; also sheet 1,2,3,5,6,8
+5V: B1.+ D14.C ; also sheet 1,2,3,5,6,7
BUTTON1: R90.1 ; also sheet 8
BUTTON2: R93.1 ; also sheet 8
BUTTON3: R96.1 ; also sheet 8
BUTTON4: R100.1 ; also sheet 8
BUTTON-1: C13.1 JP43.1 R90.2 S3.C(S) S3.D(S1) S4.C(S) S4.D(S1) ; also sheet 3
BUTTON-2: C12.1 JP43.3 R93.2 S5.C(S) S5.D(S1) S6.C(S) S6.D(S1) ; also sheet 3
BUTTON-3: C11.1 JP43.5 R96.2 S7.C(S) S7.D(S1) S8.C(S) S8.D(S1) ; also sheet 3
BUTTON-4: C10.1 JP43.7 R100.2 S9.C(S) S9.D(S1) S10.C(S) S10.D(S1) ; also sheet 3
BUTTON-OFF: C9.1 JP45.1 R102.2 S11.C(S) S11.D(S1) S12.C(S) S12.D(S1) ; also sheet 3
BUTTON-ON: JP45.3 ; also sheet 1,3
BUTTON_OFF: D13.1(A1) R102.1 ; also sheet 8
BUZZER: R108.1 ; also sheet 8
BUZZER-: B1.- D14.A Q10.3(D)
BUZZER-GATE: JP44.1 Q10.1(G) R108.2 R109.1 ; also sheet 3
ESP_EN: D13.2(A2) JP45.5 R107.1 S13.C(S) S13.D(S1) S14.C(S) S14.D(S1) ; also sheet 2,3,7,8
GND: C9.2 C10.2 C11.2 C12.2 C13.2 IM3.1(GND) IM4.1(GND) JP42.2 JP42.4 JP42.6 JP42.8 JP43.2 JP43.4 JP43.6 JP43.8 JP45.2 JP45.4 JP45.6 JP45.8 LED13.C LED14.C LED15.C LED16.C LED17.C LED18.C LED19.C LED20.C Q10.2(S) R109.2 R110.1 R111.1 R112.1 R113.1 S3.A(P) S3.B(P1) S4.A(P) S4.B(P1) S5.A(P) S5.B(P1) S6.A(P) S6.B(P1) S7.A(P) S7.B(P1) S8.A(P) S8.B(P1) S9.A(P) S9.B(P1) S10.A(P) S10.B(P1) S11.A(P) S11.B(P1) S12.A(P) S12.B(P1) S13.A(P) S13.B(P1) S14.A(P) S14.B(P1) ; also sheet 1,2,3,5,6,7,8
LED1: R91.1 R92.1 R103.1 ; also sheet 8
LED2: R94.1 R95.1 R104.1 ; also sheet 8
LED3: R97.1 R98.1 R105.1 ; also sheet 8
LED4: R99.1 R101.1 R106.1 ; also sheet 8
LED-1: JP42.1 R103.2 ; also sheet 3
LED-2: JP42.3 R104.2 ; also sheet 3
LED-3: JP42.5 R105.2 ; also sheet 3
LED-4: JP42.7 R106.2 ; also sheet 3
LED_1: LED13.A R91.2
LED_1B: LED14.A R92.2
LED_2: LED15.A R94.2
LED_2B: LED16.A R95.2
LED_3: LED17.A R97.2
LED_3B: LED18.A R98.2
LED_4: LED19.A R99.2
LED_4B: LED20.A R101.2
NRST: JP45.7 ; also sheet 3,8
PWRLED_+3V3S1: LED23.C R112.2
PWRLED_+3V3S_B1: LED24.C R113.2
PWRLED_VCC1: LED21.C R110.2
PWRLED_VCC_B1: LED22.C R111.2
STM-I2C-SCL: IM3.3(SCL) IM4.3(SCL) ; also sheet 3,8
STM-I2C-SDA: IM3.4(SDA) IM4.4(SDA) ; also sheet 3,8
VCC: LED21.A LED22.A ; also sheet 1,2,3,5,6

### Notes on the sheet
- Released under the Creative Commons Attribution-ShareAlike 4.0 License
  https://creativecommons.org/licenses/by-sa/4.0/
  Designed by: Jaroslav Paral, Jakub Streit
  
  RB3204-RBCX
  https://github.com/RoboticsBrno/RB3204-RBCX
- RB3204-RBCX
- RobotikaBrno
  RobotikaBrno.cz
  Robotarna
  CC BY-SA 4.0
- Jaroslav Paral
  Jakub Streit
  6/2020
- v1.1

## Sheet 5 of 8: Motors
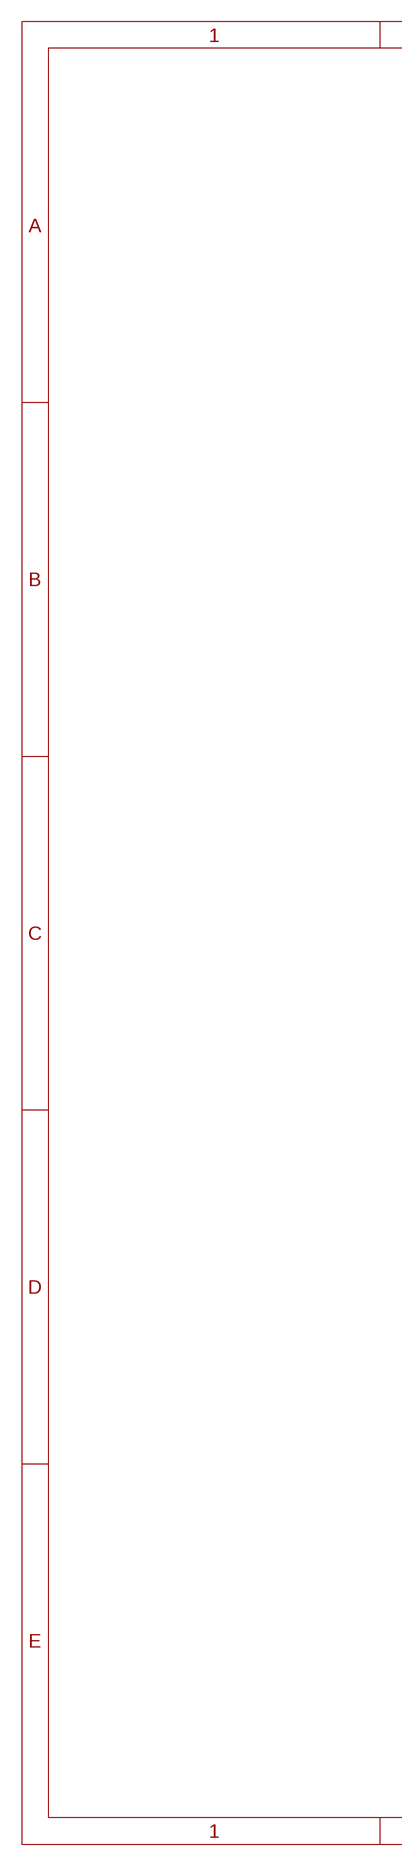
[diagram p8: schematic, sheet 5, part 1 of 2]
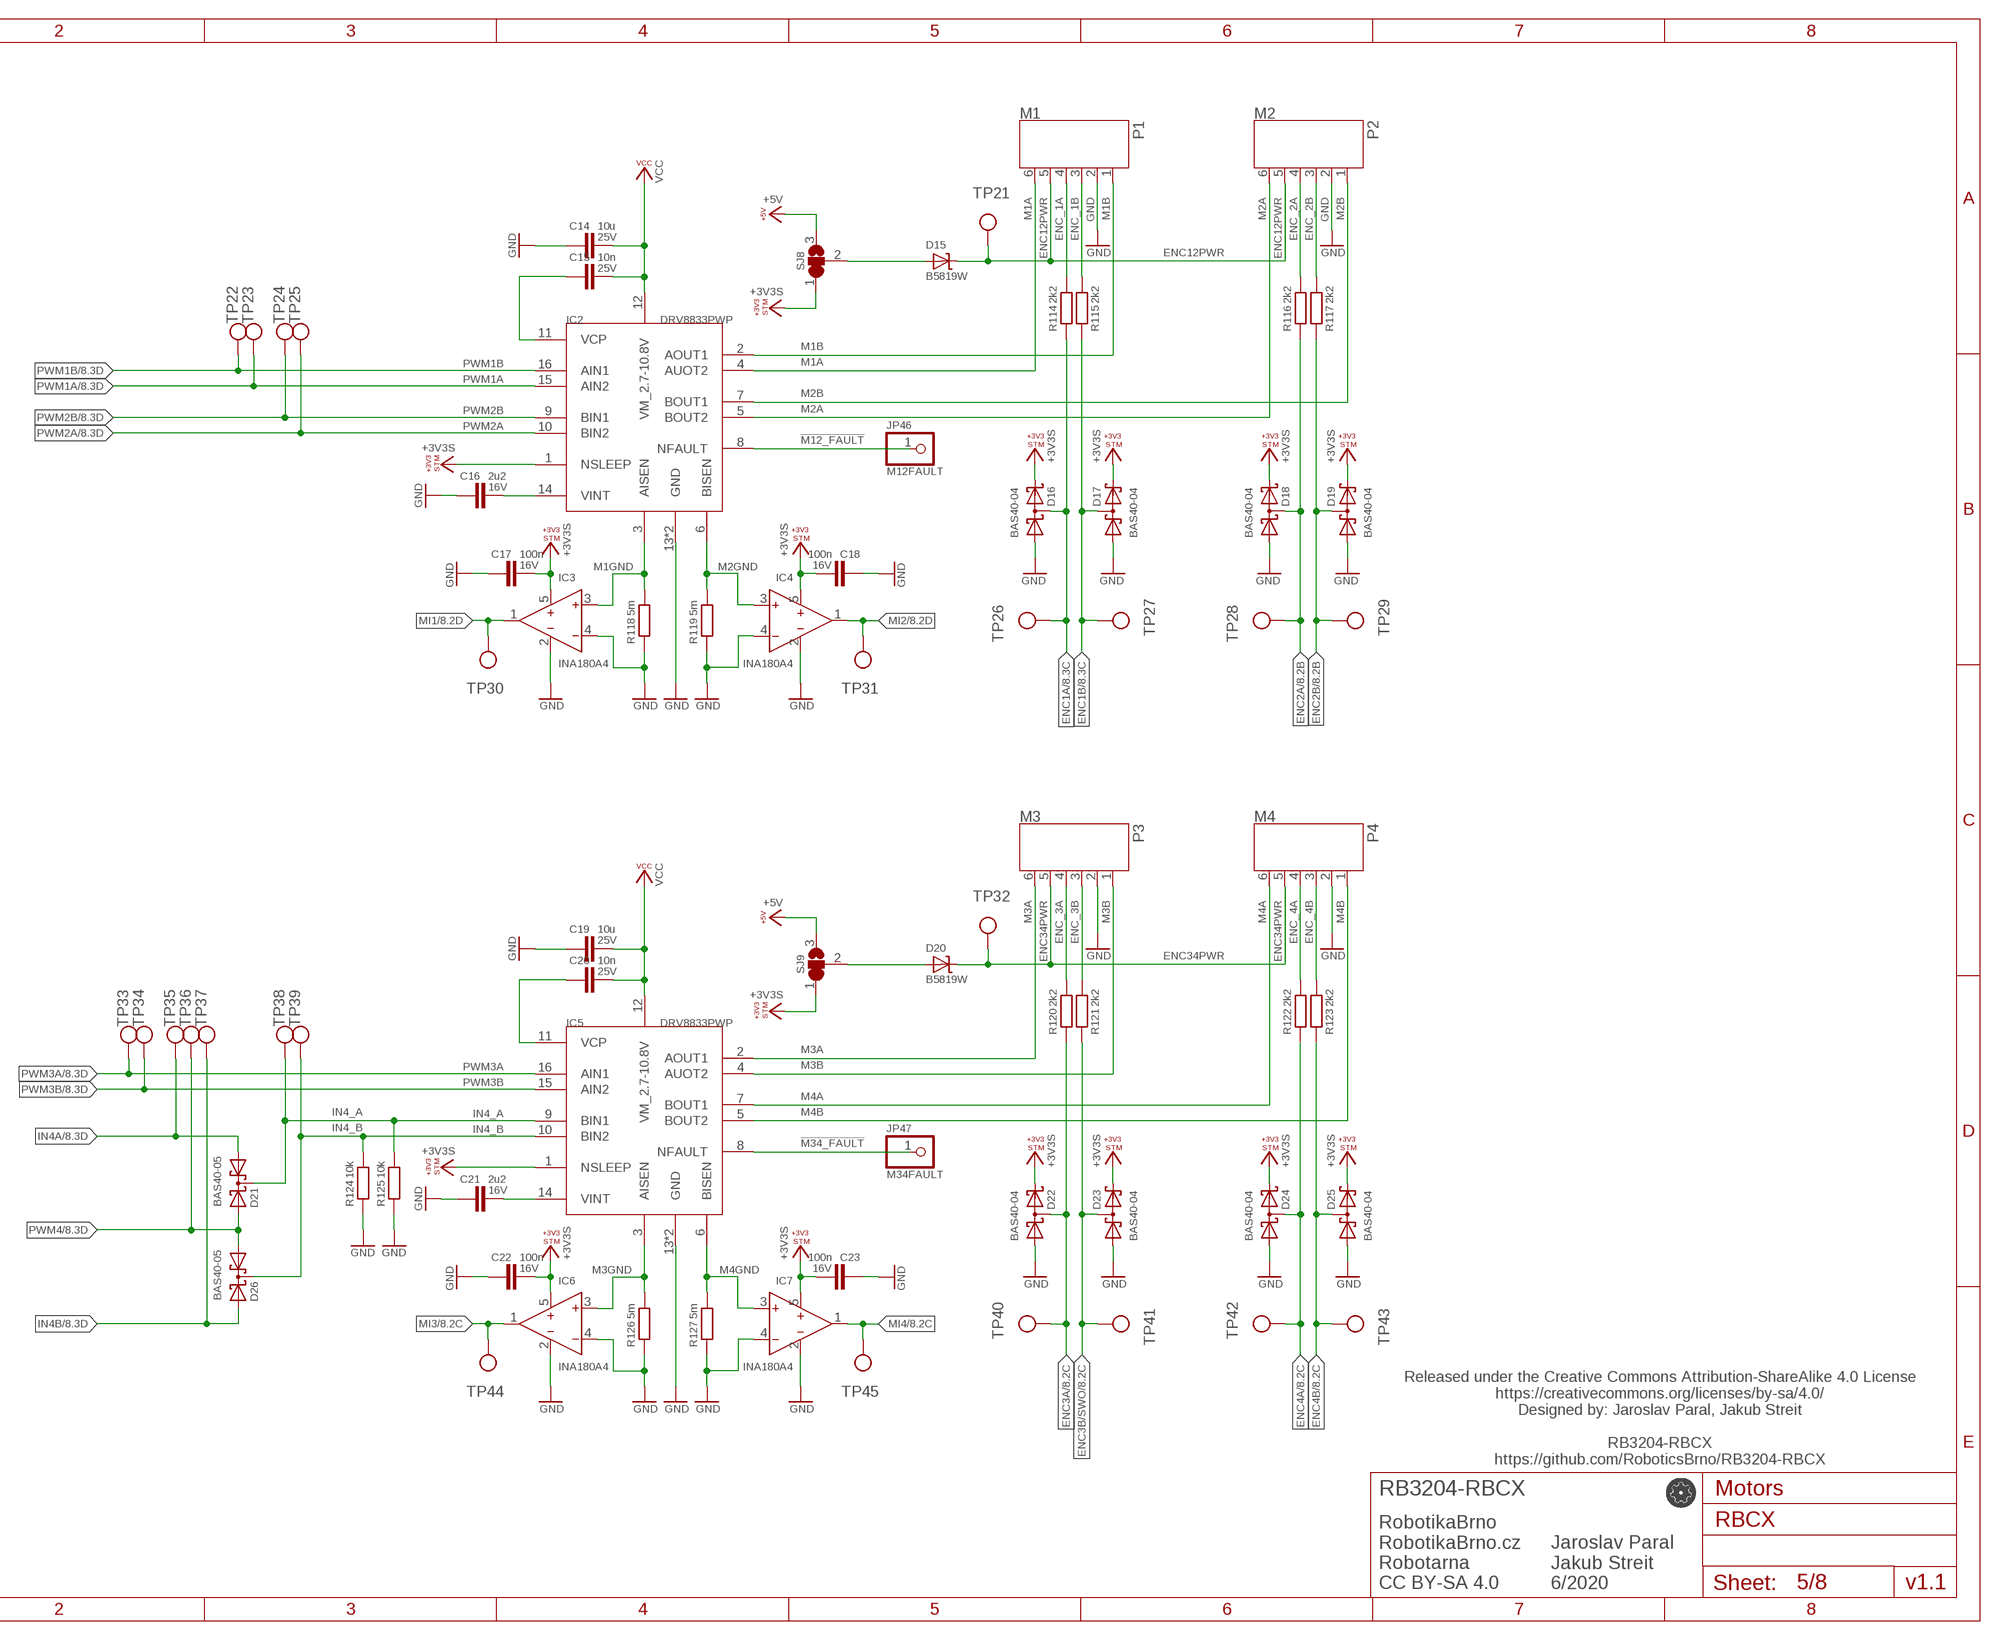
[diagram p9: schematic, sheet 5, part 2 of 2]

### Parts
C14  10u  C-EUC0805  [C0805]
C15  10n  C-EUC0402  [C0402]
C16  2u2  C-EUC0603  [C0603]
C17  100n  C-EUC0402  [C0402]
C18  100n  C-EUC0402  [C0402]
C19  10u  C-EUC0805  [C0805]
C20  10n  C-EUC0402  [C0402]
C21  2u2  C-EUC0603  [C0603]
C22  100n  C-EUC0402  [C0402]
C23  100n  C-EUC0402  [C0402]
D15  B5819W  SHOTTKY-SOD123  [SOD123]
D16  BAS40-04  [SOT23]
D17  BAS40-04  [SOT23]
D18  BAS40-04  [SOT23]
D19  BAS40-04  [SOT23]
D20  B5819W  SHOTTKY-SOD123  [SOD123]
D21  BAS40-05  [SOT23]
D22  BAS40-04  [SOT23]
D23  BAS40-04  [SOT23]
D24  BAS40-04  [SOT23]
D25  BAS40-04  [SOT23]
D26  BAS40-05  [SOT23]
IC2  DRV8833PWP  [HTSSOP]
IC3  INA180A4  INA180A  [SOT23-5L]
IC4  INA180A4  INA180A  [SOT23-5L]
IC5  DRV8833PWP  [HTSSOP]
IC6  INA180A4  INA180A  [SOT23-5L]
IC7  INA180A4  INA180A  [SOT23-5L]
JP46  M12FAULT  PINHD-1X1  [1X01]
JP47  M34FAULT  PINHD-1X1  [1X01]
P1  M1  JST-PH6  [JST-PH6]
P2  M2  JST-PH6  [JST-PH6]
P3  M3  JST-PH6  [JST-PH6]
P4  M4  JST-PH6  [JST-PH6]
R114  2k2  R-EU_R0402  [R0402]
R115  2k2  R-EU_R0402  [R0402]
R116  2k2  R-EU_R0402  [R0402]
R117  2k2  R-EU_R0402  [R0402]
R118  5m  R-EU_R1206  [R1206]
R119  5m  R-EU_R1206  [R1206]
R120  2k2  R-EU_R0402  [R0402]
R121  2k2  R-EU_R0402  [R0402]
R122  2k2  R-EU_R0402  [R0402]
R123  2k2  R-EU_R0402  [R0402]
R124  10k  R-EU_R0402  [R0402]
R125  10k  R-EU_R0402  [R0402]
R126  5m  R-EU_R1206  [R1206]
R127  5m  R-EU_R1206  [R1206]
SJ8  SJ2W_DEFAULT  [SJ_2_DEFAULT]
SJ9  SJ2W_DEFAULT  [SJ_2_DEFAULT]
TP21  TP_06MM  [TP_06]
TP22  TP_06MM  [TP_06]
TP23  TP_06MM  [TP_06]
TP24  TP_06MM  [TP_06]
TP25  TP_06MM  [TP_06]
TP26  TP_06MM  [TP_06]
TP27  TP_06MM  [TP_06]
TP28  TP_06MM  [TP_06]
TP29  TP_06MM  [TP_06]
TP30  TP_06MM  [TP_06]
TP31  TP_06MM  [TP_06]
TP32  TP_06MM  [TP_06]
TP33  TP_06MM  [TP_06]
TP34  TP_06MM  [TP_06]
TP35  TP_06MM  [TP_06]
TP36  TP_06MM  [TP_06]
TP37  TP_06MM  [TP_06]
TP38  TP_06MM  [TP_06]
TP39  TP_06MM  [TP_06]
TP40  TP_06MM  [TP_06]
TP41  TP_06MM  [TP_06]
TP42  TP_06MM  [TP_06]
TP43  TP_06MM  [TP_06]
TP44  TP_06MM  [TP_06]
TP45  TP_06MM  [TP_06]

### Nets
!M12_FAULT: IC2.8(NFAULT) JP46.1
!M34_FAULT: IC5.8(NFAULT) JP47.1
+3V3S: C17.1 C18.1 C22.1 C23.1 D16.2(C2) D17.2(C2) D18.2(C2) D19.2(C2) D22.2(C2) D23.2(C2) D24.2(C2) D25.2(C2) IC2.1(NSLEEP) IC3.5(VCC) IC4.5(VCC) IC5.1(NSLEEP) IC6.5(VCC) IC7.5(VCC) SJ8.1 SJ9.1 ; also sheet 1,2,3,4,6,8
+5V: SJ8.3 SJ9.3 ; also sheet 1,2,3,4,6,7
ENC1A: D16.3(C1A2) R114.1 TP26.P$1(TP) ; also sheet 8
ENC1B: D17.3(C1A2) R115.1 TP27.P$1(TP) ; also sheet 8
ENC2A: D18.3(C1A2) R116.1 TP28.P$1(TP) ; also sheet 8
ENC2B: D19.3(C1A2) R117.1 TP29.P$1(TP) ; also sheet 8
ENC3A: D22.3(C1A2) R120.1 TP40.P$1(TP) ; also sheet 8
ENC3B/SWO: D23.3(C1A2) R121.1 TP41.P$1(TP) ; also sheet 3,8
ENC4A: D24.3(C1A2) R122.1 TP42.P$1(TP) ; also sheet 8
ENC4B: D25.3(C1A2) R123.1 TP43.P$1(TP) ; also sheet 8
ENC12_PWR: D15.A SJ8.2
ENC12PWR: D15.C P1.5 P2.5 TP21.P$1(TP)
ENC34_PWR: D20.A SJ9.2
ENC34PWR: D20.C P3.5 P4.5 TP32.P$1(TP)
ENC_1A: P1.4 R114.2
ENC_1B: P1.3 R115.2
ENC_2A: P2.4 R116.2
ENC_2B: P2.3 R117.2
ENC_3A: P3.4 R120.2
ENC_3B: P3.3 R121.2
ENC_4A: P4.4 R122.2
ENC_4B: P4.3 R123.2
GND: C14.2 C16.2 C17.2 C18.2 C19.2 C21.2 C22.2 C23.2 D16.1(A1) D17.1(A1) D18.1(A1) D19.1(A1) D22.1(A1) D23.1(A1) D24.1(A1) D25.1(A1) IC2.13(GND) IC2.GND IC3.2(GND) IC3.4(IN-) IC4.2(GND) IC4.4(IN-) IC5.13(GND) IC5.GND IC6.2(GND) IC6.4(IN-) IC7.2(GND) IC7.4(IN-) P1.2 P2.2 P3.2 P4.2 R118.1 R119.1 R124.1 R125.1 R126.1 R127.1 ; also sheet 1,2,3,4,6,7,8
IN4_A: D21.3(C) IC5.9(BIN1) R125.2 TP38.P$1(TP)
IN4_B: D26.3(C) IC5.10(BIN2) R124.2 TP39.P$1(TP)
IN4A: D21.1(A1) TP35.P$1(TP) ; also sheet 8
IN4B: D26.2(A2) TP37.P$1(TP) ; also sheet 8
M1A: IC2.4(AUOT2) P1.6
M1B: IC2.2(AOUT1) P1.1
M1GND: IC2.3(AISEN) IC3.3(IN+) R118.2
M2A: IC2.5(BOUT2) P2.6
M2B: IC2.7(BOUT1) P2.1
M2GND: IC2.6(BISEN) IC4.3(IN+) R119.2
M3A: IC5.2(AOUT1) P3.6
M3B: IC5.4(AUOT2) P3.1
M3GND: IC5.3(AISEN) IC6.3(IN+) R126.2
M4A: IC5.7(BOUT1) P4.6
M4B: IC5.5(BOUT2) P4.1
M4GND: IC5.6(BISEN) IC7.3(IN+) R127.2
MI1: IC3.1(OUT) TP30.P$1(TP) ; also sheet 8
MI2: IC4.1(OUT) TP31.P$1(TP) ; also sheet 8
MI3: IC6.1(OUT) TP44.P$1(TP) ; also sheet 8
MI4: IC7.1(OUT) TP45.P$1(TP) ; also sheet 8
PWM1A: IC2.15(AIN2) TP23.P$1(TP) ; also sheet 8
PWM1B: IC2.16(AIN1) TP22.P$1(TP) ; also sheet 8
PWM2A: IC2.10(BIN2) TP25.P$1(TP) ; also sheet 8
PWM2B: IC2.9(BIN1) TP24.P$1(TP) ; also sheet 8
PWM3A: IC5.16(AIN1) TP33.P$1(TP) ; also sheet 8
PWM3B: IC5.15(AIN2) TP34.P$1(TP) ; also sheet 8
PWM4: D21.2(A2) D26.1(A1) TP36.P$1(TP) ; also sheet 8
VCC: C14.1 C15.1 C19.1 C20.1 IC2.12(VM_2.7-10.8V) IC5.12(VM_2.7-10.8V) ; also sheet 1,2,3,4,6
VCP12: C15.2 IC2.11(VCP)
VCP34: C20.2 IC5.11(VCP)
VINT12: C16.1 IC2.14(VINT)
VINT34: C21.1 IC5.14(VINT)

### Notes on the sheet
- Released under the Creative Commons Attribution-ShareAlike 4.0 License
  https://creativecommons.org/licenses/by-sa/4.0/
  Designed by: Jaroslav Paral, Jakub Streit
  
  RB3204-RBCX
  https://github.com/RoboticsBrno/RB3204-RBCX
- RB3204-RBCX
- RobotikaBrno
  RobotikaBrno.cz
  Robotarna
  CC BY-SA 4.0
- Jaroslav Paral
  Jakub Streit
  6/2020
- v1.1

## Sheet 6 of 8: Servos
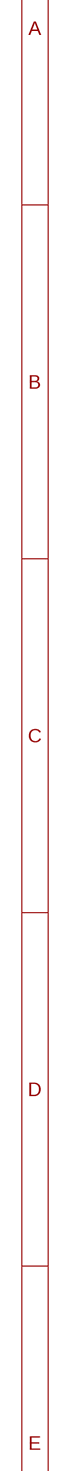
[diagram p10: schematic, sheet 6, part 1 of 2]
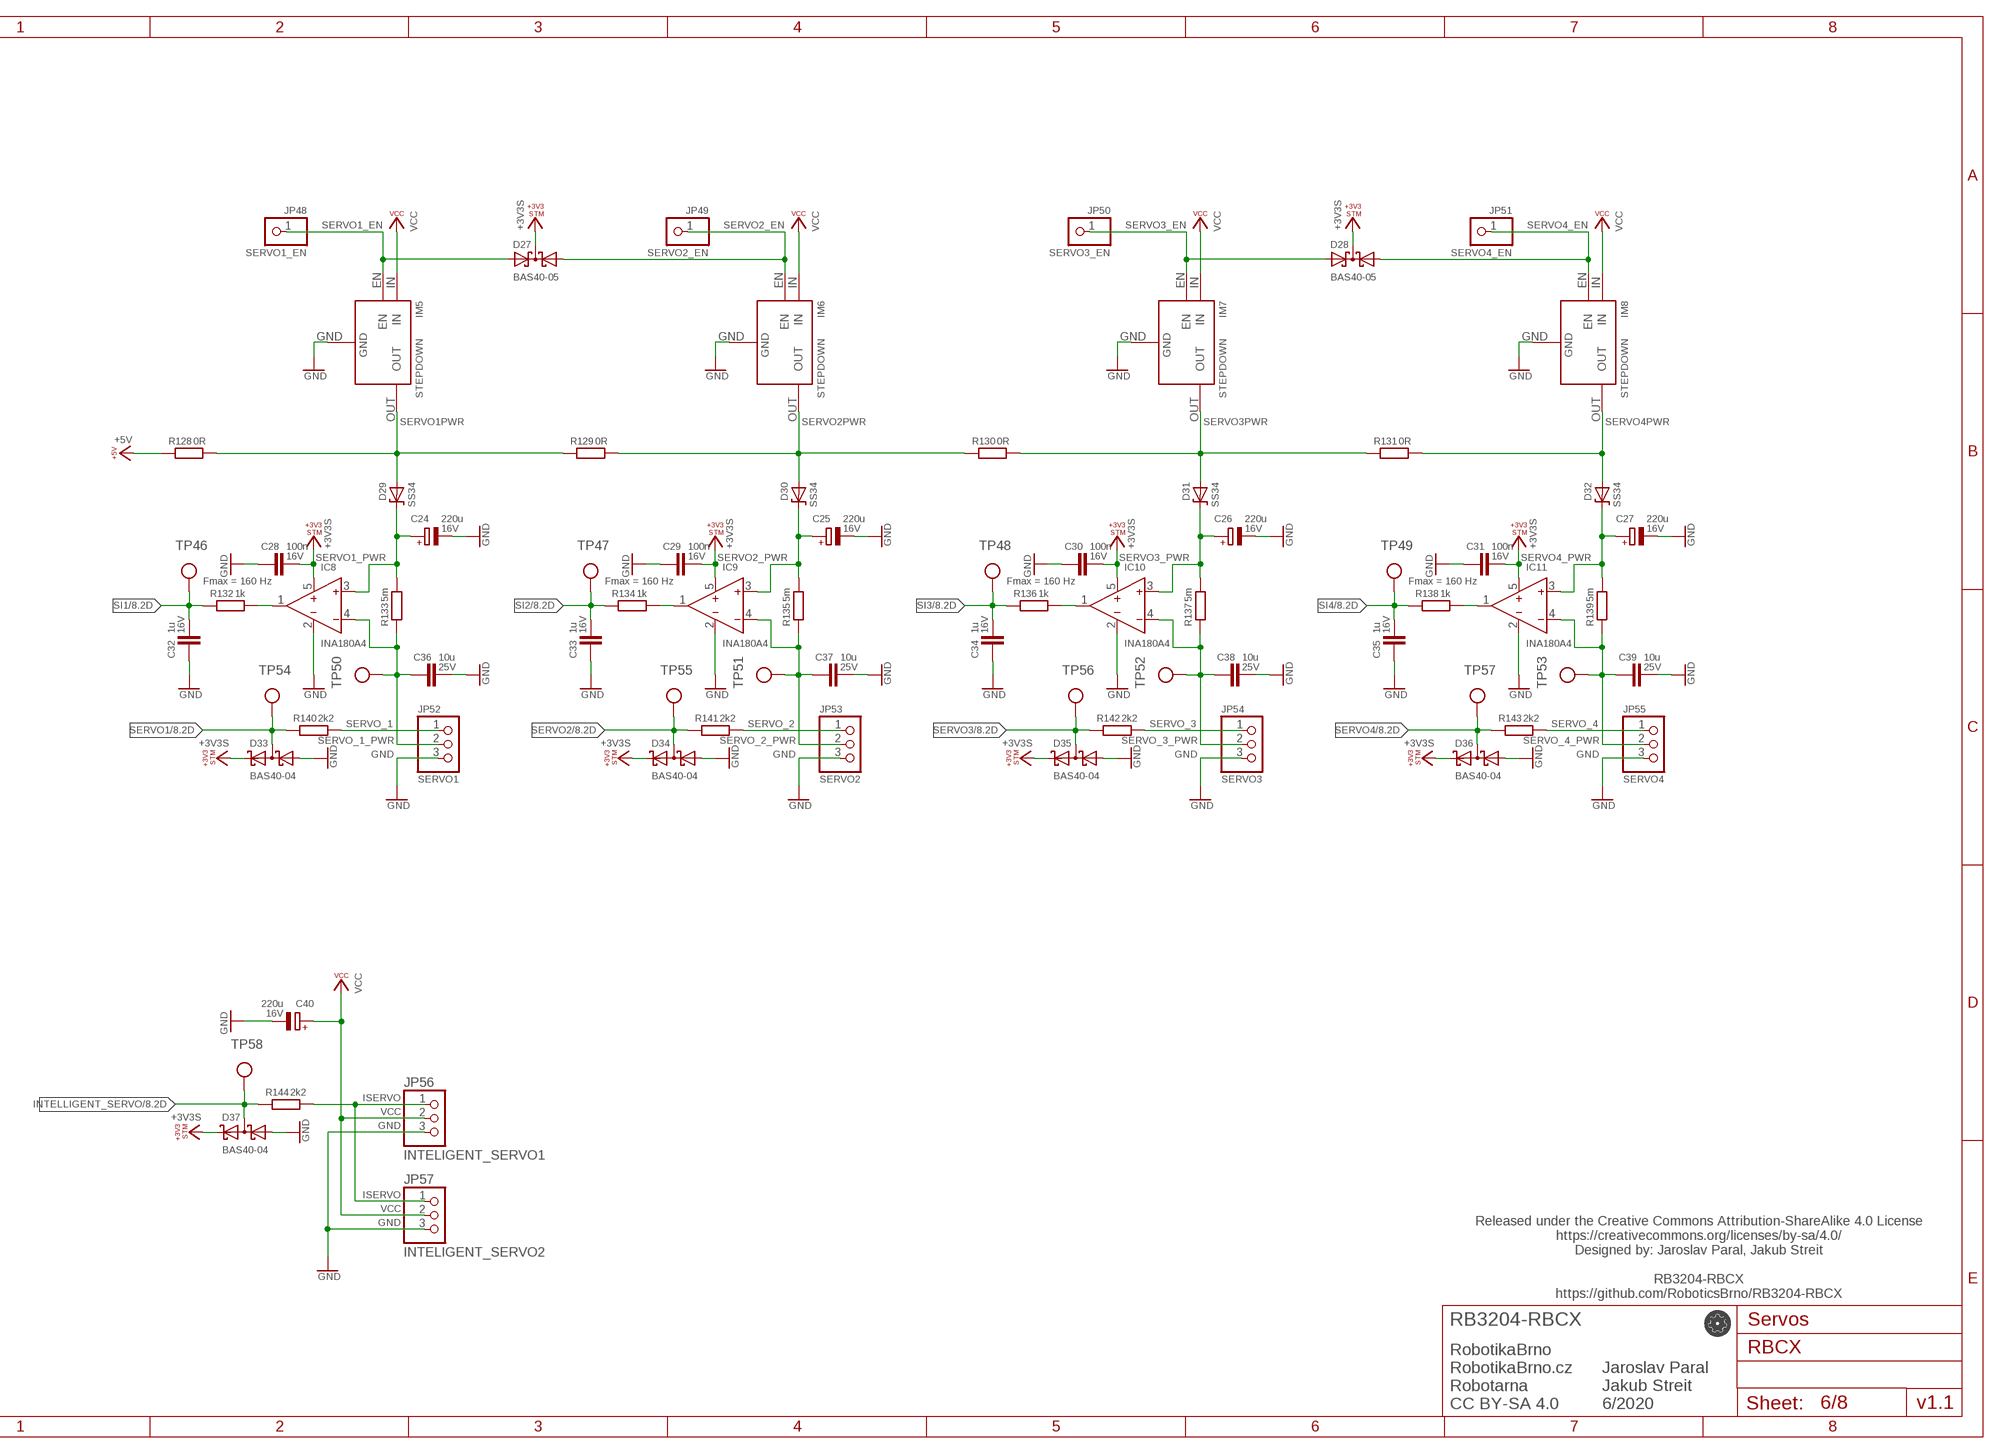
[diagram p11: schematic, sheet 6, part 2 of 2]

### Parts
C24  220u  CPOL-EUE5-10.5  [E5-10,5]
C25  220u  CPOL-EUE5-10.5  [E5-10,5]
C26  220u  CPOL-EUE5-10.5  [E5-10,5]
C27  220u  CPOL-EUE5-10.5  [E5-10,5]
C28  100n  C-EUC0402  [C0402]
C29  100n  C-EUC0402  [C0402]
C30  100n  C-EUC0402  [C0402]
C31  100n  C-EUC0402  [C0402]
C32  1u  C-EUC0402  [C0402]
C33  1u  C-EUC0402  [C0402]
C34  1u  C-EUC0402  [C0402]
C35  1u  C-EUC0402  [C0402]
C36  10u  C-EUC0805  [C0805]
C37  10u  C-EUC0805  [C0805]
C38  10u  C-EUC0805  [C0805]
C39  10u  C-EUC0805  [C0805]
C40  220u  CPOL-EUE5-10.5  [E5-10,5]
D27  BAS40-05  [SOT23]
D28  BAS40-05  [SOT23]
D29  SS34  SHOTTKY-SMA  [SMA]
D30  SS34  SHOTTKY-SMA  [SMA]
D31  SS34  SHOTTKY-SMA  [SMA]
D32  SS34  SHOTTKY-SMA  [SMA]
D33  BAS40-04  [SOT23]
D34  BAS40-04  [SOT23]
D35  BAS40-04  [SOT23]
D36  BAS40-04  [SOT23]
D37  BAS40-04  [SOT23]
IC8  INA180A4  INA180A  [SOT23-5L]
IC9  INA180A4  INA180A  [SOT23-5L]
IC10  INA180A4  INA180A  [SOT23-5L]
IC11  INA180A4  INA180A  [SOT23-5L]
IM5  STEPDOWN  [STEPDOWN]
IM6  STEPDOWN  [STEPDOWN]
IM7  STEPDOWN  [STEPDOWN]
IM8  STEPDOWN  [STEPDOWN]
JP48  SERVO1_EN  PINHD-1X1  [1X01]
JP49  SERVO2_EN  PINHD-1X1  [1X01]
JP50  SERVO3_EN  PINHD-1X1  [1X01]
JP51  SERVO4_EN  PINHD-1X1  [1X01]
JP52  SERVO1  PINHD-1X3  [1X03]
JP53  SERVO2  PINHD-1X3  [1X03]
JP54  SERVO3  PINHD-1X3  [1X03]
JP55  SERVO4  PINHD-1X3  [1X03]
JP56  INTELIGENT_SERVO1  292161-3  [292161-3]
JP57  INTELIGENT_SERVO2  292161-3  [292161-3]
R128  0R  R-EU_R1206  [R1206]
R129  0R  R-EU_R1206  [R1206]
R130  0R  R-EU_R1206  [R1206]
R131  0R  R-EU_R1206  [R1206]
R132  1k  R-EU_R0402  [R0402]
R133  5m  R-EU_R1206  [R1206]
R134  1k  R-EU_R0402  [R0402]
R135  5m  R-EU_R1206  [R1206]
R136  1k  R-EU_R0402  [R0402]
R137  5m  R-EU_R1206  [R1206]
R138  1k  R-EU_R0402  [R0402]
R139  5m  R-EU_R1206  [R1206]
R140  2k2  R-EU_R0402  [R0402]
R141  2k2  R-EU_R0402  [R0402]
R142  2k2  R-EU_R0402  [R0402]
R143  2k2  R-EU_R0402  [R0402]
R144  2k2  R-EU_R0402  [R0402]
TP46  TP_06MM  [TP_06]
TP47  TP_06MM  [TP_06]
TP48  TP_06MM  [TP_06]
TP49  TP_06MM  [TP_06]
TP50  TP_06MM  [TP_06]
TP51  TP_06MM  [TP_06]
TP52  TP_06MM  [TP_06]
TP53  TP_06MM  [TP_06]
TP54  TP_06MM  [TP_06]
TP55  TP_06MM  [TP_06]
TP56  TP_06MM  [TP_06]
TP57  TP_06MM  [TP_06]
TP58  TP_06MM  [TP_06]

### Nets
+3V3S: C28.1 C29.1 C30.1 C31.1 D27.3(C) D28.3(C) D33.2(C2) D34.2(C2) D35.2(C2) D36.2(C2) D37.2(C2) IC8.5(VCC) IC9.5(VCC) IC10.5(VCC) IC11.5(VCC) ; also sheet 1,2,3,4,5,8
+5V: R128.1 ; also sheet 1,2,3,4,5,7
GND: C24.- C25.- C26.- C27.- C28.2 C29.2 C30.2 C31.2 C32.2 C33.2 C34.2 C35.2 C36.1 C37.1 C38.1 C39.1 C40.- D33.1(A1) D34.1(A1) D35.1(A1) D36.1(A1) D37.1(A1) IC8.2(GND) IC9.2(GND) IC10.2(GND) IC11.2(GND) IM5.GND IM6.GND IM7.GND IM8.GND JP52.3 JP53.3 JP54.3 JP55.3 JP56.3 JP57.3 ; also sheet 1,2,3,4,5,7,8
INTELLIGENT_SERVO: D37.3(C1A2) R144.1 TP58.P$1(TP) ; also sheet 8
ISERVO: JP56.1 JP57.1 R144.2
SERVO1: D33.3(C1A2) R140.1 TP54.P$1(TP) ; also sheet 8
SERVO1_EN: D27.2(A2) IM5.EN JP48.1
SERVO1_PWR: C24.+ D29.C IC8.3(IN+) R133.2
SERVO1PWR: D29.A IM5.OUT R128.2 R129.1
SERVO2: D34.3(C1A2) R141.1 TP55.P$1(TP) ; also sheet 8
SERVO2_EN: D27.1(A1) IM6.EN JP49.1
SERVO2_PWR: C25.+ D30.C IC9.3(IN+) R135.2
SERVO2PWR: D30.A IM6.OUT R129.2 R130.1
SERVO3: D35.3(C1A2) R142.1 TP56.P$1(TP) ; also sheet 8
SERVO3_EN: D28.2(A2) IM7.EN JP50.1
SERVO3_PWR: C26.+ D31.C IC10.3(IN+) R137.2
SERVO3PWR: D31.A IM7.OUT R130.2 R131.1
SERVO4: D36.3(C1A2) R143.1 TP57.P$1(TP) ; also sheet 8
SERVO4_EN: D28.1(A1) IM8.EN JP51.1
SERVO4_PWR: C27.+ D32.C IC11.3(IN+) R139.2
SERVO4PWR: D32.A IM8.OUT R131.2
SERVO_1: JP52.1 R140.2
SERVO_1_PWR: C36.2 IC8.4(IN-) JP52.2 R133.1 TP50.P$1(TP)
SERVO_2: JP53.1 R141.2
SERVO_2_PWR: C37.2 IC9.4(IN-) JP53.2 R135.1 TP51.P$1(TP)
SERVO_3: JP54.1 R142.2
SERVO_3_PWR: C38.2 IC10.4(IN-) JP54.2 R137.1 TP52.P$1(TP)
SERVO_4: JP55.1 R143.2
SERVO_4_PWR: C39.2 IC11.4(IN-) JP55.2 R139.1 TP53.P$1(TP)
SI1: C32.1 R132.1 TP46.P$1(TP) ; also sheet 8
SI2: C33.1 R134.1 TP47.P$1(TP) ; also sheet 8
SI3: C34.1 R136.1 TP48.P$1(TP) ; also sheet 8
SI4: C35.1 R138.1 TP49.P$1(TP) ; also sheet 8
SI_1: IC8.1(OUT) R132.2
SI_2: IC9.1(OUT) R134.2
SI_3: IC10.1(OUT) R136.2
SI_4: IC11.1(OUT) R138.2
VCC: C40.+ IM5.IN IM6.IN IM7.IN IM8.IN JP56.2 JP57.2 ; also sheet 1,2,3,4,5

### Notes on the sheet
- Fmax = 160 Hz | Fmax = 160 Hz | Fmax = 160 Hz | Fmax = 160 Hz
- Released under the Creative Commons Attribution-ShareAlike 4.0 License
  https://creativecommons.org/licenses/by-sa/4.0/
  Designed by: Jaroslav Paral, Jakub Streit
  
  RB3204-RBCX
  https://github.com/RoboticsBrno/RB3204-RBCX
- RB3204-RBCX
- RobotikaBrno
  RobotikaBrno.cz
  Robotarna
  CC BY-SA 4.0
- Jaroslav Paral
  Jakub Streit
  6/2020
- v1.1

## Sheet 7 of 8: ESP
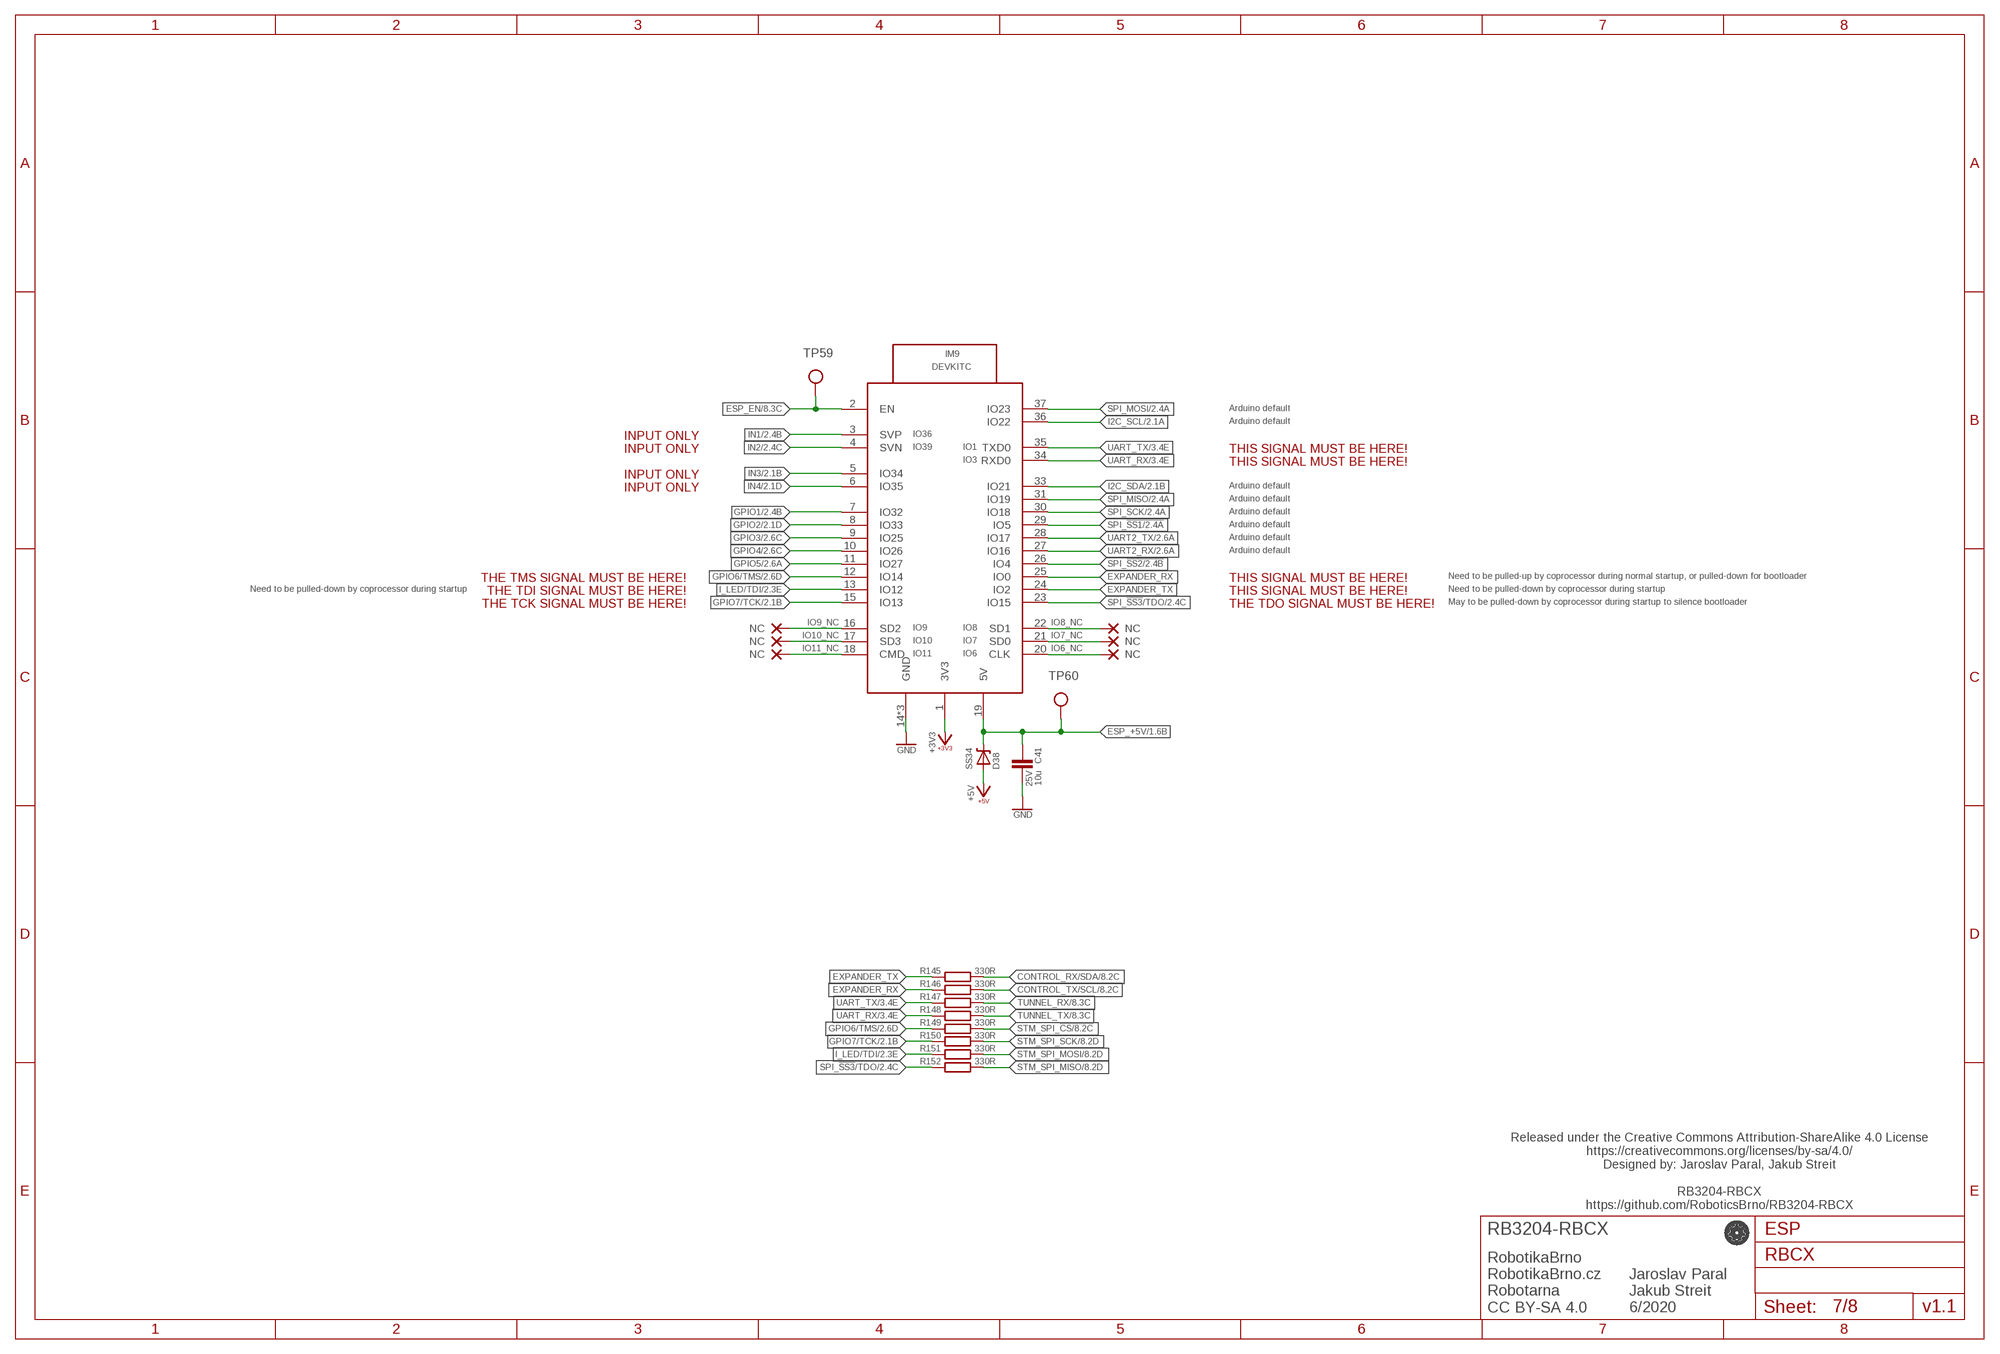
[diagram p12: schematic, sheet 7]

### Parts
C41  10u  C-EUC0805  [C0805]
D38  SS34  SHOTTKY-SMA  [SMA]
IM9  DEVKITC  [DEVKITC]
NC1  NC  (no package)
NC2  NC  (no package)
NC3  NC  (no package)
NC4  NC  (no package)
NC5  NC  (no package)
NC6  NC  (no package)
R145  330R  R-EU_R0402  [R0402]
R146  330R  R-EU_R0402  [R0402]
R147  330R  R-EU_R0402  [R0402]
R148  330R  R-EU_R0402  [R0402]
R149  330R  R-EU_R0402  [R0402]
R150  330R  R-EU_R0402  [R0402]
R151  330R  R-EU_R0402  [R0402]
R152  330R  R-EU_R0402  [R0402]
TP59  TP_06MM  [TP_06]
TP60  TP_06MM  [TP_06]

### Nets
+3V3: IM9.1(3V3) ; also sheet 1,2,3
+5V: D38.A ; also sheet 1,2,3,4,5,6
CONTROL_RX/SDA: R145.2 ; also sheet 3,8
CONTROL_TX/SCL: R146.2 ; also sheet 3,8
ESP_+5V: C41.2 D38.C IM9.19(5V) TP60.P$1(TP) ; also sheet 1
ESP_EN: IM9.2(EN) TP59.P$1(TP) ; also sheet 2,3,4,8
EXPANDER_RX: IM9.25(IO0) R146.1
EXPANDER_TX: IM9.24(IO2) R145.1
GND: C41.1 IM9.14(GND) IM9.32(GND) IM9.38(GND) ; also sheet 1,2,3,4,5,6,8
GPIO1: IM9.7(IO32) ; also sheet 2
GPIO2: IM9.8(IO33) ; also sheet 2
GPIO3: IM9.9(IO25) ; also sheet 2
GPIO4: IM9.10(IO26) ; also sheet 2
GPIO5: IM9.11(IO27) ; also sheet 2
GPIO6/TMS: IM9.12(IO14) R149.1 ; also sheet 2,3
GPIO7/TCK: IM9.15(IO13) R150.1 ; also sheet 2,3
I2C_SCL: IM9.36(IO22) ; also sheet 2
I2C_SDA: IM9.33(IO21) ; also sheet 2
I_LED/TDI: IM9.13(IO12) R151.1 ; also sheet 2,3
IN1: IM9.3(SVP) ; also sheet 2
IN2: IM9.4(SVN) ; also sheet 2
IN3: IM9.5(IO34) ; also sheet 2
IN4: IM9.6(IO35) ; also sheet 2
IO6_NC: IM9.20(CLK) NC4.NC
IO7_NC: IM9.21(SD0) NC5.NC
IO8_NC: IM9.22(SD1) NC6.NC
IO9_NC: IM9.16(SD2) NC1.NC
IO10_NC: IM9.17(SD3) NC2.NC
IO11_NC: IM9.18(CMD) NC3.NC
SPI_!SS1: IM9.29(IO5) ; also sheet 2
SPI_!SS2: IM9.26(IO4) ; also sheet 2
SPI_!SS3!/TDO: IM9.23(IO15) R152.1 ; also sheet 2,3
SPI_MISO: IM9.31(IO19) ; also sheet 2
SPI_MOSI: IM9.37(IO23) ; also sheet 2
SPI_SCK: IM9.30(IO18) ; also sheet 2
STM_SPI_!CS: R149.2 ; also sheet 3,8
STM_SPI_MISO: R152.2 ; also sheet 3,8
STM_SPI_MOSI: R151.2 ; also sheet 8
STM_SPI_SCK: R150.2 ; also sheet 8
TUNNEL_RX: R147.2 ; also sheet 8
TUNNEL_TX: R148.2 ; also sheet 8
UART2_RX: IM9.27(IO16) ; also sheet 2
UART2_TX: IM9.28(IO17) ; also sheet 2
UART_RX: IM9.34(RXD0) R148.1 ; also sheet 3
UART_TX: IM9.35(TXD0) R147.1 ; also sheet 3

### Notes on the sheet
- Arduino default
- Arduino default
- INPUT ONLY
- INPUT ONLY | THIS SIGNAL MUST BE HERE!
- THIS SIGNAL MUST BE HERE!
- INPUT ONLY
- INPUT ONLY | Arduino default
- Arduino default
- Arduino default
- Arduino default
- Arduino default
- Arduino default
- THE TMS SIGNAL MUST BE HERE! | THIS SIGNAL MUST BE HERE! | Need to be pulled-up by coprocessor during normal startup, or pulled-down for bootloader
- Need to be pulled-down by coprocessor during startup | THE TDI SIGNAL MUST BE HERE! | THIS SIGNAL MUST BE HERE! | Need to be pulled-down by coprocessor during startup
- THE TCK SIGNAL MUST BE HERE! | THE TDO SIGNAL MUST BE HERE! | May to be pulled-down by coprocessor during startup to silence bootloader
- Released under the Creative Commons Attribution-ShareAlike 4.0 License
  https://creativecommons.org/licenses/by-sa/4.0/
  Designed by: Jaroslav Paral, Jakub Streit
  
  RB3204-RBCX
  https://github.com/RoboticsBrno/RB3204-RBCX
- RB3204-RBCX
- RobotikaBrno
  RobotikaBrno.cz
  Robotarna
  CC BY-SA 4.0
- Jaroslav Paral
  Jakub Streit
  6/2020
- v1.1

## Sheet 8 of 8: Coprocessor
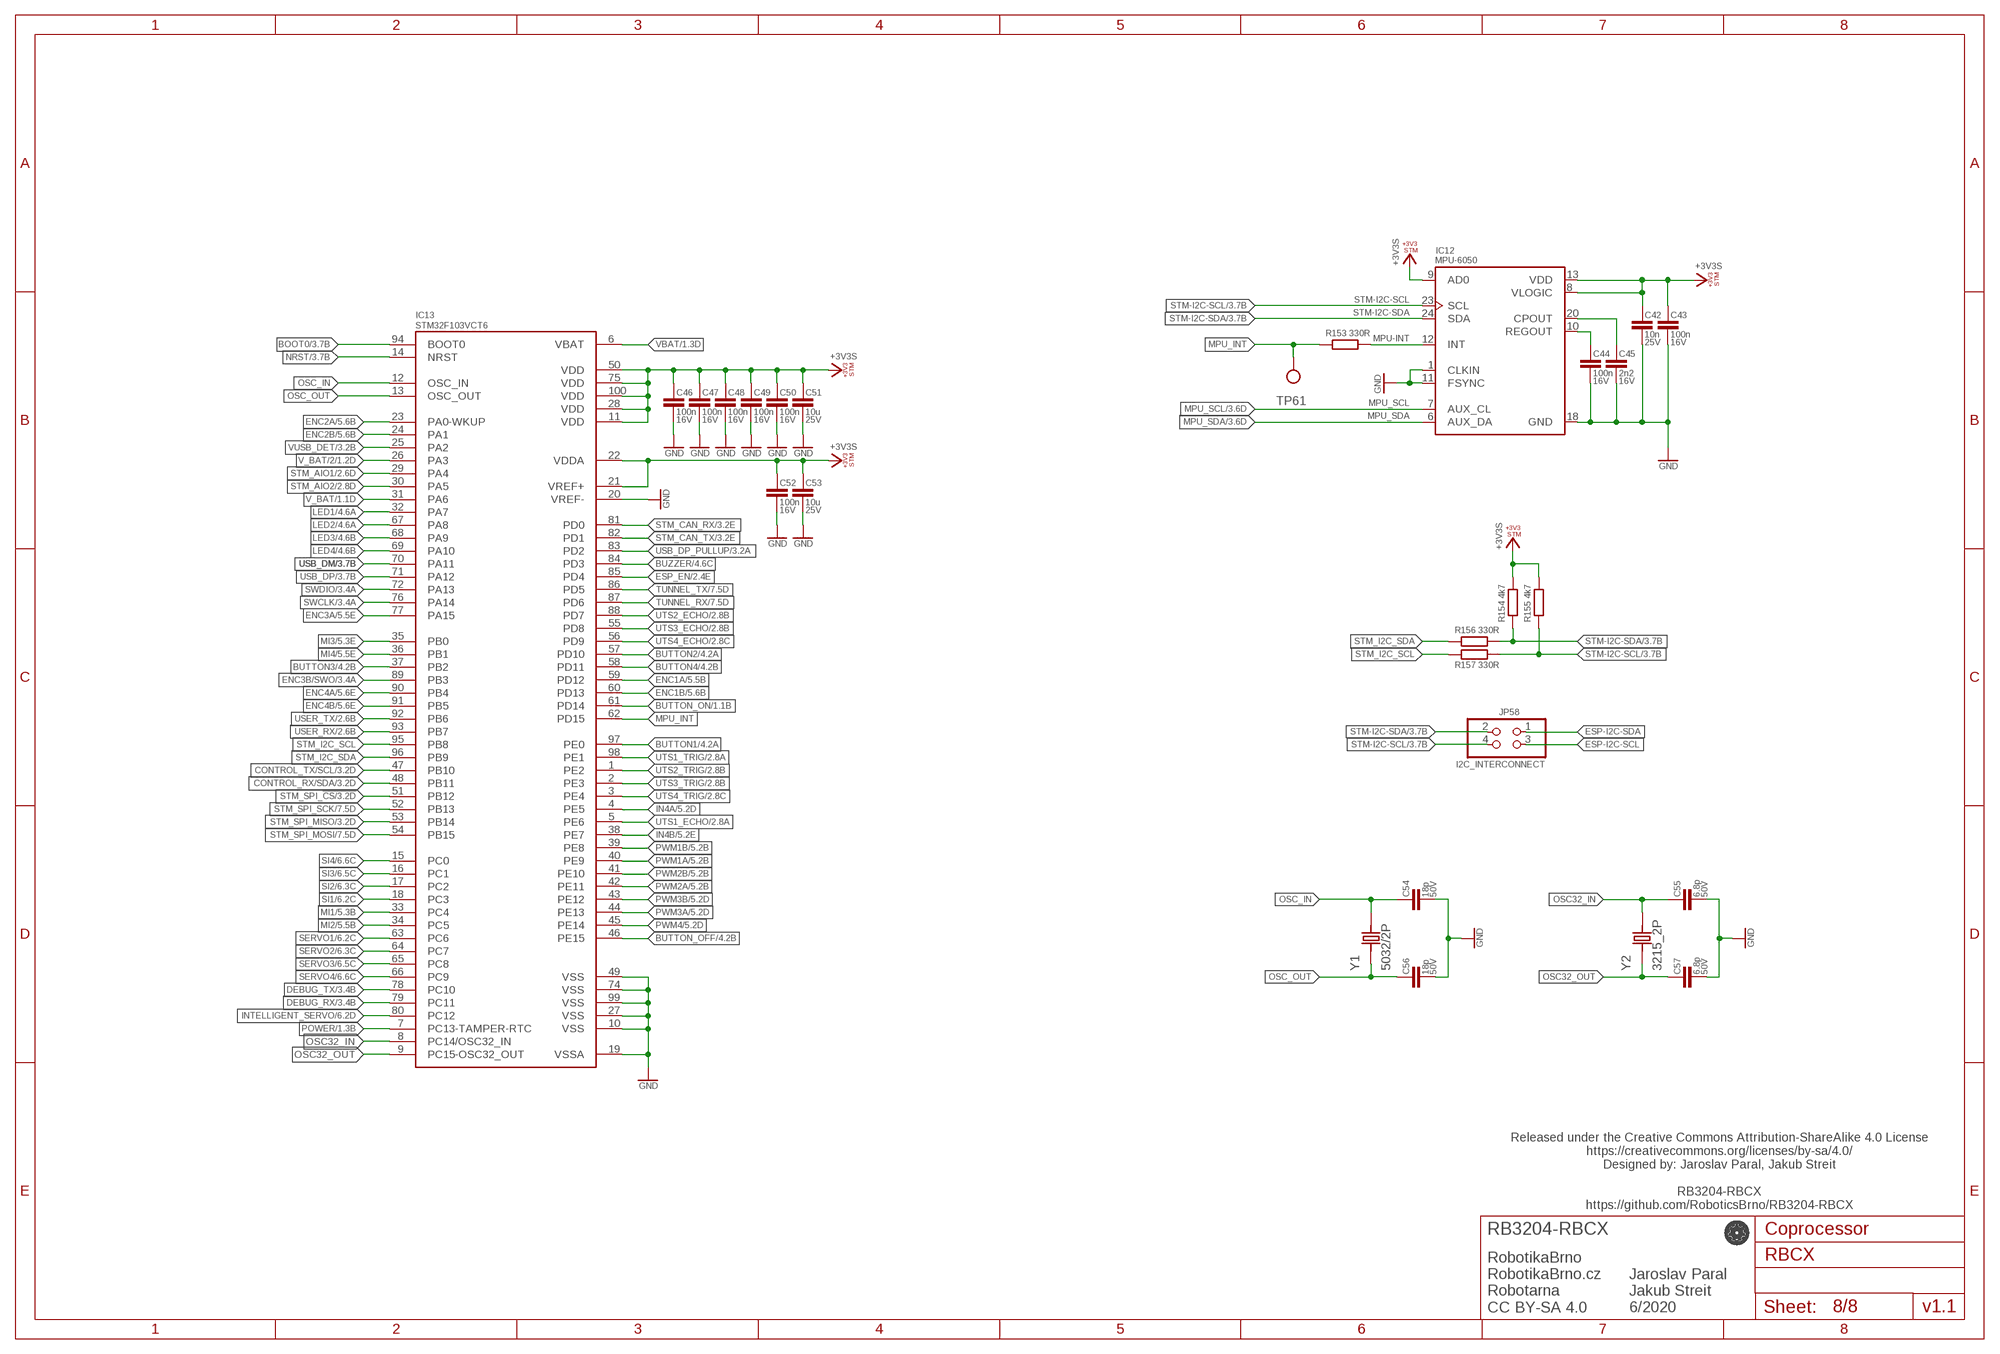
[diagram p13: schematic, sheet 8]

### Parts
C42  10n  C-EUC0402  [C0402]
C43  100n  C-EUC0402  [C0402]
C44  100n  C-EUC0402  [C0402]
C45  2n2  C-EUC0402  [C0402]
C46  100n  C-EUC0402  [C0402]
C47  100n  C-EUC0402  [C0402]
C48  100n  C-EUC0402  [C0402]
C49  100n  C-EUC0402  [C0402]
C50  100n  C-EUC0402  [C0402]
C51  10u  C-EUC0805  [C0805]
C52  100n  C-EUC0402  [C0402]
C53  10u  C-EUC0805  [C0805]
C54  18p  C-EUC0402  [C0402]
C55  6.8p  C-EUC0402  [C0402]
C56  18p  C-EUC0402  [C0402]
C57  6.8p  C-EUC0402  [C0402]
IC12  MPU-6050  [QFN50P400X400X95-24N]
IC13  STM32F103VCT6  [QFP50P1600X1600X160-100N_STM32F103VCT6]
JP58  I2C_INTERCONNECT  PINHD-2X2  [2X02]
R153  330R  R-EU_R0402  [R0402]
R154  4k7  R-EU_R0402  [R0402]
R155  4k7  R-EU_R0402  [R0402]
R156  330R  R-EU_R0402  [R0402]
R157  330R  R-EU_R0402  [R0402]
TP61  TP_06MM  [TP_06]
Y1  5032/2P  [OSCCC500X320X135]
Y2  3215_2P  [SMD-3215_2P]

### Nets
+3V3S: C42.1 C43.2 C46.2 C47.2 C48.2 C49.2 C50.2 C51.2 C52.2 C53.2 IC12.8(VLOGIC) IC12.9(AD0) IC12.13(VDD) IC13.11(VDD) IC13.21(VREF+) IC13.22(VDDA) IC13.28(VDD) IC13.50(VDD) IC13.75(VDD) IC13.100(VDD) R154.2 R155.2 ; also sheet 1,2,3,4,5,6
BOOT0: IC13.94(BOOT0) ; also sheet 3
BUTTON1: IC13.97(PE0) ; also sheet 4
BUTTON2: IC13.57(PD10) ; also sheet 4
BUTTON3: IC13.37(PB2) ; also sheet 4
BUTTON4: IC13.58(PD11) ; also sheet 4
BUTTON_OFF: IC13.46(PE15) ; also sheet 4
BUTTON_ON: IC13.61(PD14) ; also sheet 1
BUZZER: IC13.84(PD3) ; also sheet 4
CONTROL_RX/SDA: IC13.48(PB11) ; also sheet 3,7
CONTROL_TX/SCL: IC13.47(PB10) ; also sheet 3,7
CPOUT: C45.2 IC12.20(CPOUT)
DEBUG_RX: IC13.79(PC11) ; also sheet 3
DEBUG_TX: IC13.78(PC10) ; also sheet 3
ENC1A: IC13.59(PD12) ; also sheet 5
ENC1B: IC13.60(PD13) ; also sheet 5
ENC2A: IC13.23(PA0-WKUP) ; also sheet 5
ENC2B: IC13.24(PA1) ; also sheet 5
ENC3A: IC13.77(PA15) ; also sheet 5
ENC3B/SWO: IC13.89(PB3) ; also sheet 3,5
ENC4A: IC13.90(PB4) ; also sheet 5
ENC4B: IC13.91(PB5) ; also sheet 5
ESP-I2C-SCL: JP58.3 ; also sheet 2
ESP-I2C-SDA: JP58.1 ; also sheet 2
ESP_EN: IC13.85(PD4) ; also sheet 2,3,4,7
GND: C42.2 C43.1 C44.1 C45.1 C46.1 C47.1 C48.1 C49.1 C50.1 C51.1 C52.1 C53.1 C54.1 C55.1 C56.1 C57.1 IC12.1(CLKIN) IC12.11(FSYNC) IC12.18(GND) IC13.10(VSS) IC13.19(VSSA) IC13.20(VREF-) IC13.27(VSS) IC13.49(VSS) IC13.74(VSS) IC13.99(VSS) ; also sheet 1,2,3,4,5,6,7
IN4A: IC13.4(PE5) ; also sheet 5
IN4B: IC13.38(PE7) ; also sheet 5
INTELLIGENT_SERVO: IC13.80(PC12) ; also sheet 6
LED1: IC13.32(PA7) ; also sheet 4
LED2: IC13.67(PA8) ; also sheet 4
LED3: IC13.68(PA9) ; also sheet 4
LED4: IC13.69(PA10) ; also sheet 4
MI1: IC13.33(PC4) ; also sheet 5
MI2: IC13.34(PC5) ; also sheet 5
MI3: IC13.35(PB0) ; also sheet 5
MI4: IC13.36(PB1) ; also sheet 5
MPU-INT: IC12.12(INT) R153.2
MPU_INT: IC13.62(PD15) R153.1 TP61.P$1(TP)
MPU_SCL: IC12.7(AUX_CL) ; also sheet 3
MPU_SDA: IC12.6(AUX_DA) ; also sheet 3
NRST: IC13.14(NRST) ; also sheet 3,4
OSC32_IN: C55.2 IC13.8(PC14/OSC32_IN) Y2.2
OSC32_OUT: C57.2 IC13.9(PC15-OSC32_OUT) Y2.1
OSC_IN: C54.2 IC13.12(OSC_IN) Y1.2
OSC_OUT: C56.2 IC13.13(OSC_OUT) Y1.1
POWER: IC13.7(PC13-TAMPER-RTC) ; also sheet 1
PWM1A: IC13.40(PE9) ; also sheet 5
PWM1B: IC13.39(PE8) ; also sheet 5
PWM2A: IC13.42(PE11) ; also sheet 5
PWM2B: IC13.41(PE10) ; also sheet 5
PWM3A: IC13.44(PE13) ; also sheet 5
PWM3B: IC13.43(PE12) ; also sheet 5
PWM4: IC13.45(PE14) ; also sheet 5
REGOUT: C44.2 IC12.10(REGOUT)
SERVO1: IC13.63(PC6) ; also sheet 6
SERVO2: IC13.64(PC7) ; also sheet 6
SERVO3: IC13.65(PC8) ; also sheet 6
SERVO4: IC13.66(PC9) ; also sheet 6
SI1: IC13.18(PC3) ; also sheet 6
SI2: IC13.17(PC2) ; also sheet 6
SI3: IC13.16(PC1) ; also sheet 6
SI4: IC13.15(PC0) ; also sheet 6
STM-I2C-SCL: IC12.23(SCL) JP58.4 R155.1 R157.2 ; also sheet 3,4
STM-I2C-SDA: IC12.24(SDA) JP58.2 R154.1 R156.2 ; also sheet 3,4
STM_AIO1: IC13.29(PA4) ; also sheet 2
STM_AIO2: IC13.30(PA5) ; also sheet 2
STM_CAN_RX: IC13.81(PD0) ; also sheet 3
STM_CAN_TX: IC13.82(PD1) ; also sheet 3
STM_I2C_SCL: IC13.95(PB8) R157.1
STM_I2C_SDA: IC13.96(PB9) R156.1
STM_SPI_!CS: IC13.51(PB12) ; also sheet 3,7
STM_SPI_MISO: IC13.53(PB14) ; also sheet 3,7
STM_SPI_MOSI: IC13.54(PB15) ; also sheet 7
STM_SPI_SCK: IC13.52(PB13) ; also sheet 7
SWCLK: IC13.76(PA14) ; also sheet 3
SWDIO: IC13.72(PA13) ; also sheet 3
TUNNEL_RX: IC13.87(PD6) ; also sheet 7
TUNNEL_TX: IC13.86(PD5) ; also sheet 7
USB_DM: IC13.70(PA11) ; also sheet 3
USB_DP: IC13.71(PA12) ; also sheet 3
USB_DP_PULLUP: IC13.83(PD2) ; also sheet 3
USER_RX: IC13.93(PB7) ; also sheet 2
USER_TX: IC13.92(PB6) ; also sheet 2
UTS1_ECHO: IC13.5(PE6) ; also sheet 2
UTS1_TRIG: IC13.98(PE1) ; also sheet 2
UTS2_ECHO: IC13.88(PD7) ; also sheet 2
UTS2_TRIG: IC13.1(PE2) ; also sheet 2
UTS3_ECHO: IC13.55(PD8) ; also sheet 2
UTS3_TRIG: IC13.2(PE3) ; also sheet 2
UTS4_ECHO: IC13.56(PD9) ; also sheet 2
UTS4_TRIG: IC13.3(PE4) ; also sheet 2
V_BAT: IC13.31(PA6) ; also sheet 1
V_BAT/2: IC13.26(PA3) ; also sheet 1
VBAT: IC13.6(VBAT) ; also sheet 1
VUSB_DET: IC13.25(PA2) ; also sheet 3

### Notes on the sheet
- Released under the Creative Commons Attribution-ShareAlike 4.0 License
  https://creativecommons.org/licenses/by-sa/4.0/
  Designed by: Jaroslav Paral, Jakub Streit
  
  RB3204-RBCX
  https://github.com/RoboticsBrno/RB3204-RBCX
- RB3204-RBCX
- RobotikaBrno
  RobotikaBrno.cz
  Robotarna
  CC BY-SA 4.0
- Jaroslav Paral
  Jakub Streit
  6/2020
- v1.1

## Library data of the parts
B1 = piezo:PIEZO
BAT1 = CR2032-circle:CR2032; DESCRIPTION: SMD BATTERY HOLDERS, CLIPS & CONTACTS ROHS; LCSC_ID: C70377; MF_ID: CR2032-BS-6-1; PACKAGE: SMD-BAT-CR2032-BS-6-1; PRICE_10PLUS: $0.0972; PRICE_1PLUS: $0.1305
C1 C2 C24-C27 C40 = rcl_upravena:CPOL-EU: POLARIZED CAPACITOR, European symbol; VOLTAGE: 16V
C3 C4 C14 C15 C19 C20 C36-C39 C41 C42 C51 C53 = rcl_upravena:C-EU: CAPACITOR, European symbol; DIELECTRIC: X5R; VOLTAGE: 25V
C5-C13 C16-C18 C21-C23 C28-C35 C43-C50 C52 = rcl_upravena:C-EU: CAPACITOR, European symbol; DIELECTRIC: X5R; VOLTAGE: 16V
C54-C57 = rcl_upravena:C-EU: CAPACITOR, European symbol; DIELECTRIC: np0; VOLTAGE: 50V
D1 = diode:DIODE: DIODE ultra fast-recovery rectifier
D2-D8 D12 D29-D32 D38 = diode:SHOTTKY
D9 D16-D19 D22-D25 D33-D37 = diode:BAS40-04: Silicon Schottky Diodes General-purpose diode for high-speed switching
D10 D14 D15 D20 = diode:SHOTTKY; DESCRIPTION: 40V 1A 600mV @ 1A SOD-123 Schottky Barrier Diodes (SBD) RoHS; EXTENDED: NO; LCSC_ID: C305445; MF: Foshan Blue Rocket Elec; MF_ID: B5819W; PACKAGE: SOD-123; PADS: 2; PRICE_100PLUS: $0.0176; PRICE_1PLUS: $0.0342; PRICE_DATE: 17.03.2020
D11 D13 D21 D26-D28 = diode:BAS40-05: Silicon Schottky Diodes General-purpose diode for high-speed switching
IC1 = ams1117:AMS1117: VOLTAGE REGULATOR
IC2 IC5 = DRV8833:DRV8833
IC3 IC4 IC6-IC11 = INA180:INA180; DESCRIPTION: PMIC - CURRENT & POWER MONITORS & REGULATORS 1 200 V/V ±0.1% 105KHZ -0.2V ~ 26V 2.7V ~ 5.5V SOT-23-5 ROHS; LCSC_ID: C133969; MF: TI; MF_ID: INA180A4IDBVT; PACKAGE: SOT-23-5; PRICE_100PLUS: $0.2638; PRICE_10PLUS: $0.2986; PRICE_1PLUS: $0.3943; PRICE_30PLUS: $0.2812; PRICE_500PLUS: $0.2566
IC12 = MPU-6050:MPU-6050: MPU-6050 Six-Axis (Gyro + Accelerometer) MEMS MotionTracking™ Devices; AVAILABILITY: Unavailable; DESCRIPTION: 3-axis gyroscope, 3-axis accelerometer in a 4x4x0.9 housing; MF: TDK InvenSense; MP: MPU-6050; PACKAGE: QFN-24 InvenSense; PRICE: None
IC13 = STM32F103VCT6:STM32F103VCT6: Mainstream Performance line, ARM Cortex-M3 MCU with 512 Kbytes Flash, 72 MHz CPU, motor control, USB and CAN; DESCRIPTION: ARM® Cortex®-M3 STM32F1 Microcontroller IC 32-Bit 72MHz 256KB _256K x 8_ FLASH; DIGI-KEY_PART_NUMBER: 497-9034-ND; DIGI-KEY_PURCHASE_URL: https://www.digikey.be/product-detail/en/stmicroelectronics/STM32F103VCT6/497-9034-ND/2035333?utm_source=snapeda&utm_medium=aggregator&utm_campaign=symbol; MF: STMicroelectronics; MP: STM32F103VCT6; PACKAGE: LQFP-100 STMicroelectronics
IM1 IM2 IM5-IM8 = StepDown:STEPDOWN
IM3 = diy-modules:DISPLAY-OLED-128X64-I2C: 128x64 Dot Matrix OLED Module based on SSD1306 chip Variant with I2C interface More details available here: http://www.instructables.com/id/Monochrome-096-i2c-OLED-display-with-arduino-SSD13/ SSD1306 datasheet: https://cdn-shop.adafruit.com/datasheets/SSD1306.pdf Click here to find device on ebay.com <http://www.ebay.com/sch/oled+display+128x64+iic> Note: There are two variants: I2C and SPI. Search for the proper version.
IM4 = diy-modules:DISPLAY-OLED-128X32: 128x32 Dot Matrix OLED Module with I2C interface based on SSD1306 chip More details available here: http://www.tinyosshop.com/index.php?route=product/product&product_id=953 Schematic available here: http://www.tinyosshop.com/datasheet/OLED%2012832.pdf SSD1306 datasheet: https://cdn-shop.adafruit.com/datasheets/SSD1306.pdf Click here to find device on ebay.com <http://www.ebay.com/sch/oled+display+128x32+i2c>
IM9 = esp32:DEVKITC
JP1 JP27 JP44 JP46-JP51 = pinhead:PINHD-1X1: PIN HEADER
JP2-JP5 JP29 JP42 JP43 JP45 = pinhead:PINHD-2X4: PIN HEADER
JP6 JP7 JP9 JP13 JP14 JP16 JP18 JP20 JP22 JP23 JP28 JP34 JP35 JP38 JP40 = pinhead:PINHD-1X4: PIN HEADER
JP8 JP15 JP21 JP33 JP37 JP39 JP41 = pinhead:PINHD-1X6: PIN HEADER
JP10-JP12 JP17 JP19 JP24-JP26 JP30 JP31 JP52-JP55 = pinhead:PINHD-1X3: PIN HEADER
JP32 = pinhead:PINHD-1X5: PIN HEADER
JP36 = pinhead:PINHD-1X2: PIN HEADER
JP56 JP57 = iServo_connector:292161-3; DESCRIPTION: Connector for inteligent servo LewanSoul (e.g. LX-15D); PACKAGE: 292161-3
JP58 = pinhead:PINHD-2X2: PIN HEADER
LED1-LED24 = led:LED: LED
NC1-NC6 NC8 = NC:NC: _EXTERNAL_
P1-P4 = jst-ph:JST-PH6
Q1 Q2 = transistors:P-MOSFET; DESCRIPTION: P MOSFET 19V 35A 7mΩ; EXTENDED: YES; LCSC_ID: C193354; MF: Wuxi NCE Power Semiconductor; MF_ID: NCE20P45Q; PACKAGE: DFN-8_EP_3.3x3.3x0.65P; PADS: 8; PRICE_1000PLUS: $0.1218; PRICE_100PLUS: $0.1276; PRICE_10PLUS: $0.1450; PRICE_1PLUS: $0.1928; PRICE_30PLUS: $0.1363; PRICE_500PLUS: $0.1232
Q3-Q10 = transistors:N-MOSFET; DESCRIPTION: N MOSFET 60V 115mA 7Ω; EXTENDED: NO; LCSC_ID: C8545; MF: Changjiang Electronics Tech (CJ); MF_ID: 2N7002; PACKAGE: SOT-23-3; PADS: 3; PRICE_1PLUS: $0.0236; PRICE_200PLUS: $0.0113
R1-R66 R68-R157 = rcl_upravena:R-EU_: RESISTOR, European symbol
R67 = rcl_upravena:R-EU_: RESISTOR, European symbol; EXTENDED: NO; LCSC_ID: C25867; MF: Uniroyal Elec; MF_ID: 0402WGF1501TCE; PACKAGE: R0402; PADS: 2; PRICE_1000PLUS: 0.0003; PRICE_1PLUS: 0.0009
S1-S14 = switch-omron:10-XX: OMRON SWITCH
SJ1-SJ5 SJ8 SJ9 = jumper:SJ2W_DEFAULT: SMD solder JUMPER
SJ6 SJ7 = jumper:SJ2W: SMD solder JUMPER
TP1-TP61 = test_points:TP
X1 = con-wago-508:W237-03P: WAGO SREW CLAMP; OC_FARNELL: unknown; OC_NEWARK: unknown
X2 = con-wago-508:W237-02P: WAGO SREW CLAMP; OC_FARNELL: unknown; OC_NEWARK: unknown
X3 = con-molex:52559-3092: FFC/FPC-to-Board 0.50mm (.020") SMT, Vertical, ZIF Receptacle Source: http://www.molex.com/product/ffc/52559.html; MF: MOLEX; MPN: 52559-3072; OC_FARNELL: unknown; OC_NEWARK: 57J3632
X4 = USB:614105150621: WR-COM Micro USB 2.0 Type AB Vertical 5 Contacts Kind Properties Durability:10 000 Mating cycles Quality Class:10 000 Mating cycles Connector Type:Micro USB Gender:Receptacle Type:Vertical General Information Operating Temperature:-40up to +105 °C Compliance:RoHS Electrical Properties IR 1:1.8A Working Voltage:30V (AC) Withstanding Voltage:100V (AC) Contact Resistance:30 mΩ Material Properties Insulator Material:LCP Insulator Flammability Rating:UL94 V-0 Color:Black Contact Material:Copper Alloy Contact Plating: Gold Contact Type:Stamped Shielding Material:Stainless Steel Shielding Plating:Matte Tin <https://www.we-online.com/catalog/media/o33043v209%20Family_WR-COM_Micro-USB_Type-AB_614105150621.jpg> Details see: https://www.we-online.com/catalog/en/COM_MICRO_TYPE_AB_VERTICAL/ Updated by Yingchun, Shan 2020-01-16 2020 (C) Würth Elektronik; APPLICATION: Micro USB 2.0; DATASHEET-URL: https://www.we-online.com/catalog/datasheet/614105150621.pdf; GERDER: Receptacle; INTERFACE-TYPE: TypeAB; IR1: 1.8A; MOUNT: THT; PACKAGING: Tape and Reel; PART-NUMBER: 614105150621; PINS: 5; TYPE: Vertical; WORKING-VOLTAGE: 30V(AC)
X5 = USB:USB_C_8PIN
Y1 = SMD5032_2P:5032/2P: SMD Crystal 8 Mhz-20pF-10ppm-80R;; AVAILABILITY: Unavailable; DESCRIPTION: SMD Crystal 8Mhz-20pF-10ppm-80R;; LCSC_ID: C115962; MF: Xinhunjing; MF_ID: X50328MSB2GI; MP: 5032/2P; PACKAGE: SMD-5032_2P; PRICE: $0.1707
Y2 = SMD3215_2P:3215_2P: SMD Crystal 32.768 Khz-12.5pF-20ppm; AVAILABILITY: Unavailable; DESCRIPTION: SMD Crystal 32.768Khz-12.5pF-20ppm; LCSC_ID: C32346; MF: Seiko Epson; MF_ID: Q13FC1350000400; MP: 3215/2P; PACKAGE: SMD-5032_2P; PRICE_1PLUS: $0.1544; PRICE_50PLUS: $0.0975

## Net classes
0 default: width 0.15 mm, drill 0.3 mm, clearance 0.15 mm